# Altium project Project-C_VOLTAGE.PrjPCB (part 1 of 6)
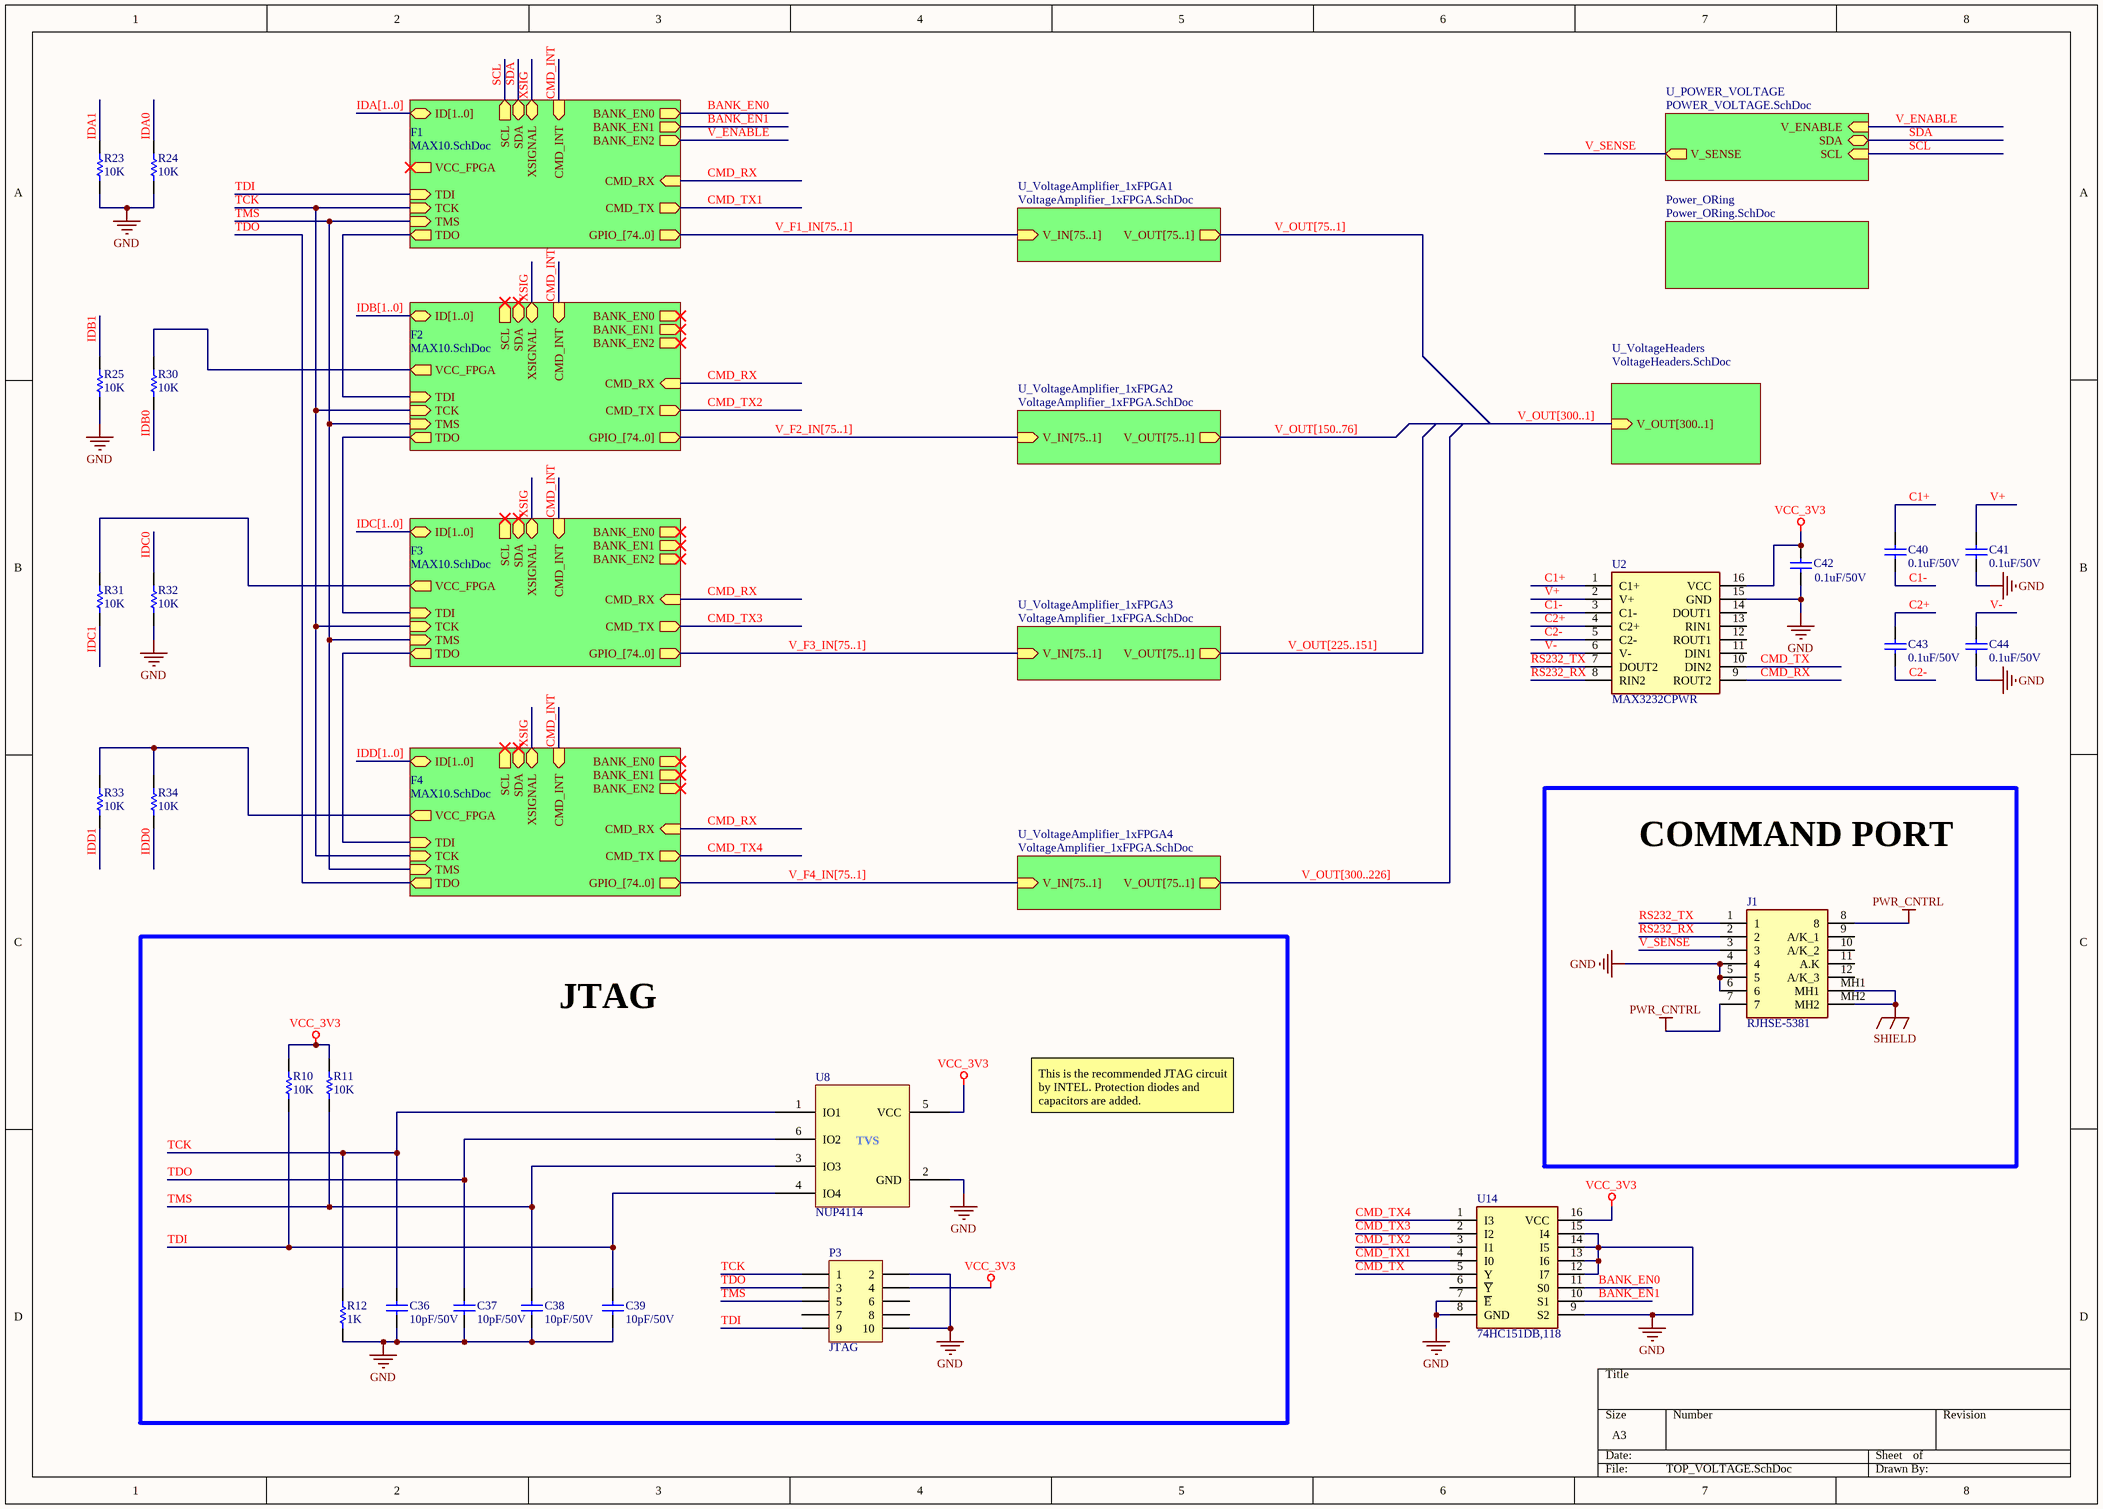
[diagram p0: TOP_VOLTAGE.SchDoc]
9 sheets, 1249 parts. Net scope: hierarchical (ports join the sheet entries above them; power ports are global).
Board file: PCB2.PcbDoc
Sheets:
  TOP_VOLTAGE.SchDoc
    F1 = MAX10.SchDoc
      IO = FPGA_IO.SchDoc
      POWER = FPGA_POWER.SchDoc
    U_VoltageHeaders = VoltageHeaders.SchDoc
    U_POWER_VOLTAGE = POWER_VOLTAGE.SchDoc
    F2 = MAX10.SchDoc
      IO = FPGA_IO.SchDoc
      POWER = FPGA_POWER.SchDoc
    F3 = MAX10.SchDoc
      IO = FPGA_IO.SchDoc
      POWER = FPGA_POWER.SchDoc
    F4 = MAX10.SchDoc
      IO = FPGA_IO.SchDoc
      POWER = FPGA_POWER.SchDoc
    Power_ORing = Power_ORing.SchDoc
    U_VoltageAmplifier_1xFPGA1 = VoltageAmplifier_1xFPGA.SchDoc
      U_VoltageAmplifier1 = VoltageAmplifier.SchDoc
      U_VoltageAmplifier2 = VoltageAmplifier.SchDoc
      U_VoltageAmplifier3 = VoltageAmplifier.SchDoc
      U_VoltageAmplifier4 = VoltageAmplifier.SchDoc
      U_VoltageAmplifier5 = VoltageAmplifier.SchDoc
      U_VoltageAmplifier6 = VoltageAmplifier.SchDoc
      U_VoltageAmplifier7 = VoltageAmplifier.SchDoc
      U_VoltageAmplifier8 = VoltageAmplifier.SchDoc
      U_VoltageAmplifier9 = VoltageAmplifier.SchDoc
      U_VoltageAmplifier10 = VoltageAmplifier.SchDoc
      U_VoltageAmplifier11 = VoltageAmplifier.SchDoc
      U_VoltageAmplifier12 = VoltageAmplifier.SchDoc
      U_VoltageAmplifier13 = VoltageAmplifier.SchDoc
      U_VoltageAmplifier14 = VoltageAmplifier.SchDoc
      U_VoltageAmplifier15 = VoltageAmplifier.SchDoc
      U_VoltageAmplifier16 = VoltageAmplifier.SchDoc
      U_VoltageAmplifier17 = VoltageAmplifier.SchDoc
      U_VoltageAmplifier18 = VoltageAmplifier.SchDoc
      U_VoltageAmplifier19 = VoltageAmplifier.SchDoc
      U_VoltageAmplifier20 = VoltageAmplifier.SchDoc
      U_VoltageAmplifier21 = VoltageAmplifier.SchDoc
      U_VoltageAmplifier22 = VoltageAmplifier.SchDoc
      U_VoltageAmplifier23 = VoltageAmplifier.SchDoc
      U_VoltageAmplifier24 = VoltageAmplifier.SchDoc
      U_VoltageAmplifier25 = VoltageAmplifier.SchDoc
      U_VoltageAmplifier26 = VoltageAmplifier.SchDoc
      U_VoltageAmplifier27 = VoltageAmplifier.SchDoc
      U_VoltageAmplifier28 = VoltageAmplifier.SchDoc
      U_VoltageAmplifier29 = VoltageAmplifier.SchDoc
      U_VoltageAmplifier30 = VoltageAmplifier.SchDoc
      U_VoltageAmplifier31 = VoltageAmplifier.SchDoc
      U_VoltageAmplifier32 = VoltageAmplifier.SchDoc
      U_VoltageAmplifier33 = VoltageAmplifier.SchDoc
      U_VoltageAmplifier34 = VoltageAmplifier.SchDoc
      U_VoltageAmplifier35 = VoltageAmplifier.SchDoc
      U_VoltageAmplifier36 = VoltageAmplifier.SchDoc
      U_VoltageAmplifier37 = VoltageAmplifier.SchDoc
      U_VoltageAmplifier38 = VoltageAmplifier.SchDoc
    U_VoltageAmplifier_1xFPGA2 = VoltageAmplifier_1xFPGA.SchDoc
      U_VoltageAmplifier1 = VoltageAmplifier.SchDoc
      U_VoltageAmplifier2 = VoltageAmplifier.SchDoc
      U_VoltageAmplifier3 = VoltageAmplifier.SchDoc
      U_VoltageAmplifier4 = VoltageAmplifier.SchDoc
      U_VoltageAmplifier5 = VoltageAmplifier.SchDoc
      U_VoltageAmplifier6 = VoltageAmplifier.SchDoc
      U_VoltageAmplifier7 = VoltageAmplifier.SchDoc
      U_VoltageAmplifier8 = VoltageAmplifier.SchDoc
      U_VoltageAmplifier9 = VoltageAmplifier.SchDoc
      U_VoltageAmplifier10 = VoltageAmplifier.SchDoc
      U_VoltageAmplifier11 = VoltageAmplifier.SchDoc
      U_VoltageAmplifier12 = VoltageAmplifier.SchDoc
      U_VoltageAmplifier13 = VoltageAmplifier.SchDoc
      U_VoltageAmplifier14 = VoltageAmplifier.SchDoc
      U_VoltageAmplifier15 = VoltageAmplifier.SchDoc
      U_VoltageAmplifier16 = VoltageAmplifier.SchDoc
      U_VoltageAmplifier17 = VoltageAmplifier.SchDoc
      U_VoltageAmplifier18 = VoltageAmplifier.SchDoc
      U_VoltageAmplifier19 = VoltageAmplifier.SchDoc
      U_VoltageAmplifier20 = VoltageAmplifier.SchDoc
      U_VoltageAmplifier21 = VoltageAmplifier.SchDoc
      U_VoltageAmplifier22 = VoltageAmplifier.SchDoc
      U_VoltageAmplifier23 = VoltageAmplifier.SchDoc
      U_VoltageAmplifier24 = VoltageAmplifier.SchDoc
      U_VoltageAmplifier25 = VoltageAmplifier.SchDoc
      U_VoltageAmplifier26 = VoltageAmplifier.SchDoc
      U_VoltageAmplifier27 = VoltageAmplifier.SchDoc
      U_VoltageAmplifier28 = VoltageAmplifier.SchDoc
      U_VoltageAmplifier29 = VoltageAmplifier.SchDoc
      U_VoltageAmplifier30 = VoltageAmplifier.SchDoc
      U_VoltageAmplifier31 = VoltageAmplifier.SchDoc
      U_VoltageAmplifier32 = VoltageAmplifier.SchDoc
      U_VoltageAmplifier33 = VoltageAmplifier.SchDoc
      U_VoltageAmplifier34 = VoltageAmplifier.SchDoc
      U_VoltageAmplifier35 = VoltageAmplifier.SchDoc
      U_VoltageAmplifier36 = VoltageAmplifier.SchDoc
      U_VoltageAmplifier37 = VoltageAmplifier.SchDoc
      U_VoltageAmplifier38 = VoltageAmplifier.SchDoc
    U_VoltageAmplifier_1xFPGA3 = VoltageAmplifier_1xFPGA.SchDoc
      U_VoltageAmplifier1 = VoltageAmplifier.SchDoc
      U_VoltageAmplifier2 = VoltageAmplifier.SchDoc
      U_VoltageAmplifier3 = VoltageAmplifier.SchDoc
      U_VoltageAmplifier4 = VoltageAmplifier.SchDoc
      U_VoltageAmplifier5 = VoltageAmplifier.SchDoc
      U_VoltageAmplifier6 = VoltageAmplifier.SchDoc
      U_VoltageAmplifier7 = VoltageAmplifier.SchDoc
      U_VoltageAmplifier8 = VoltageAmplifier.SchDoc
      U_VoltageAmplifier9 = VoltageAmplifier.SchDoc
      U_VoltageAmplifier10 = VoltageAmplifier.SchDoc
      U_VoltageAmplifier11 = VoltageAmplifier.SchDoc
      U_VoltageAmplifier12 = VoltageAmplifier.SchDoc
      U_VoltageAmplifier13 = VoltageAmplifier.SchDoc
      U_VoltageAmplifier14 = VoltageAmplifier.SchDoc
      U_VoltageAmplifier15 = VoltageAmplifier.SchDoc
      U_VoltageAmplifier16 = VoltageAmplifier.SchDoc
      U_VoltageAmplifier17 = VoltageAmplifier.SchDoc
      U_VoltageAmplifier18 = VoltageAmplifier.SchDoc
      U_VoltageAmplifier19 = VoltageAmplifier.SchDoc
      U_VoltageAmplifier20 = VoltageAmplifier.SchDoc
      U_VoltageAmplifier21 = VoltageAmplifier.SchDoc
      U_VoltageAmplifier22 = VoltageAmplifier.SchDoc
      U_VoltageAmplifier23 = VoltageAmplifier.SchDoc
      U_VoltageAmplifier24 = VoltageAmplifier.SchDoc
      U_VoltageAmplifier25 = VoltageAmplifier.SchDoc
      U_VoltageAmplifier26 = VoltageAmplifier.SchDoc
      U_VoltageAmplifier27 = VoltageAmplifier.SchDoc
      U_VoltageAmplifier28 = VoltageAmplifier.SchDoc
      U_VoltageAmplifier29 = VoltageAmplifier.SchDoc
      U_VoltageAmplifier30 = VoltageAmplifier.SchDoc
      U_VoltageAmplifier31 = VoltageAmplifier.SchDoc
      U_VoltageAmplifier32 = VoltageAmplifier.SchDoc
      U_VoltageAmplifier33 = VoltageAmplifier.SchDoc
      U_VoltageAmplifier34 = VoltageAmplifier.SchDoc
      U_VoltageAmplifier35 = VoltageAmplifier.SchDoc
      U_VoltageAmplifier36 = VoltageAmplifier.SchDoc
      U_VoltageAmplifier37 = VoltageAmplifier.SchDoc
      U_VoltageAmplifier38 = VoltageAmplifier.SchDoc
    U_VoltageAmplifier_1xFPGA4 = VoltageAmplifier_1xFPGA.SchDoc
      U_VoltageAmplifier1 = VoltageAmplifier.SchDoc
      U_VoltageAmplifier2 = VoltageAmplifier.SchDoc
      U_VoltageAmplifier3 = VoltageAmplifier.SchDoc
      U_VoltageAmplifier4 = VoltageAmplifier.SchDoc
      U_VoltageAmplifier5 = VoltageAmplifier.SchDoc
      U_VoltageAmplifier6 = VoltageAmplifier.SchDoc
      U_VoltageAmplifier7 = VoltageAmplifier.SchDoc
      U_VoltageAmplifier8 = VoltageAmplifier.SchDoc
      U_VoltageAmplifier9 = VoltageAmplifier.SchDoc
      U_VoltageAmplifier10 = VoltageAmplifier.SchDoc
      U_VoltageAmplifier11 = VoltageAmplifier.SchDoc
      U_VoltageAmplifier12 = VoltageAmplifier.SchDoc
      U_VoltageAmplifier13 = VoltageAmplifier.SchDoc
      U_VoltageAmplifier14 = VoltageAmplifier.SchDoc
      U_VoltageAmplifier15 = VoltageAmplifier.SchDoc
      U_VoltageAmplifier16 = VoltageAmplifier.SchDoc
      U_VoltageAmplifier17 = VoltageAmplifier.SchDoc
      U_VoltageAmplifier18 = VoltageAmplifier.SchDoc
      U_VoltageAmplifier19 = VoltageAmplifier.SchDoc
      U_VoltageAmplifier20 = VoltageAmplifier.SchDoc
      U_VoltageAmplifier21 = VoltageAmplifier.SchDoc
      U_VoltageAmplifier22 = VoltageAmplifier.SchDoc
      U_VoltageAmplifier23 = VoltageAmplifier.SchDoc
      U_VoltageAmplifier24 = VoltageAmplifier.SchDoc
      U_VoltageAmplifier25 = VoltageAmplifier.SchDoc
      U_VoltageAmplifier26 = VoltageAmplifier.SchDoc
      U_VoltageAmplifier27 = VoltageAmplifier.SchDoc
      U_VoltageAmplifier28 = VoltageAmplifier.SchDoc
      U_VoltageAmplifier29 = VoltageAmplifier.SchDoc
      U_VoltageAmplifier30 = VoltageAmplifier.SchDoc
      U_VoltageAmplifier31 = VoltageAmplifier.SchDoc
      U_VoltageAmplifier32 = VoltageAmplifier.SchDoc
      U_VoltageAmplifier33 = VoltageAmplifier.SchDoc
      U_VoltageAmplifier34 = VoltageAmplifier.SchDoc
      U_VoltageAmplifier35 = VoltageAmplifier.SchDoc
      U_VoltageAmplifier36 = VoltageAmplifier.SchDoc
      U_VoltageAmplifier37 = VoltageAmplifier.SchDoc
      U_VoltageAmplifier38 = VoltageAmplifier.SchDoc

## Sheet TOP_VOLTAGE.SchDoc
size A3

### Parts
C36  10pF/50V  [0603C]
C37  10pF/50V  [0603C]
C38  10pF/50V  [0603C]
C39  10pF/50V  [0603C]
C40  0.1uF/50V  [0603C]
C41  0.1uF/50V  [0603C]
C42  0.1uF/50V  [0603C]
C43  0.1uF/50V  [0603C]
C44  0.1uF/50V  [0603C]
J1  RJHSE-5381  [RJHSE5381]
P3  JTAG  [HDR2X5]  (no BOM)
R10  10K  [0603R]
R11  10K  [0603R]
R12  1K  [0603R]
R23  10K  [0603R]
R24  10K  [0603R]
R25  10K  [0603R]
R30  10K  [0603R]
R31  10K  [0603R]
R32  10K  [0603R]
R33  10K  [0603R]
R34  10K  [0603R]
U2  MAX3232CPWR  [MAX3232CPWR]
U8  NUP4114  [NUP4114HMR6T1G]
U14  74HC151DB,118  [74HC151DB,118]

### Blocks framed on the sheet
COMMAND PORT: J1
JTAG: C36-C39 P3 R10-R12 U8

### Sub-sheets
F1 = MAX10.SchDoc: TDI (in), TCK (in), TMS (in), TDO (out), CMD_RX (in), CMD_TX (out), SDA (bidir), CMD_INT (in), BANK_EN2 (out), GPIO_[74..0] (out), XSIGNAL (bidir), SCL (out), BANK_EN0 (out), BANK_EN1 (out), ID[1..0] (bidir), VCC_FPGA (out)
F2 = MAX10.SchDoc: TDI (in), TCK (in), TMS (in), TDO (out), CMD_RX (in), CMD_TX (out), SDA (bidir), CMD_INT (in), BANK_EN2 (out), GPIO_[74..0] (out), XSIGNAL (bidir), SCL (out), BANK_EN0 (out), BANK_EN1 (out), ID[1..0] (bidir), VCC_FPGA (out)
F3 = MAX10.SchDoc: TDI (in), TCK (in), TMS (in), TDO (out), CMD_RX (in), CMD_TX (out), SDA (bidir), CMD_INT (in), BANK_EN2 (out), GPIO_[74..0] (out), XSIGNAL (bidir), SCL (out), BANK_EN0 (out), BANK_EN1 (out), ID[1..0] (bidir), VCC_FPGA (out)
F4 = MAX10.SchDoc: TDI (in), TCK (in), TMS (in), TDO (out), CMD_RX (in), CMD_TX (out), SDA (bidir), CMD_INT (in), BANK_EN2 (out), GPIO_[74..0] (out), XSIGNAL (bidir), SCL (out), BANK_EN0 (out), BANK_EN1 (out), ID[1..0] (bidir), VCC_FPGA (out)
Power_ORing = Power_ORing.SchDoc: no entries
U_POWER_VOLTAGE = POWER_VOLTAGE.SchDoc: V_SENSE (out), V_ENABLE (in), SDA (bidir), SCL (in)
U_VoltageAmplifier_1xFPGA1 = VoltageAmplifier_1xFPGA.SchDoc: V_IN[75..1] (in), V_OUT[75..1] (out)
U_VoltageAmplifier_1xFPGA2 = VoltageAmplifier_1xFPGA.SchDoc: V_IN[75..1] (in), V_OUT[75..1] (out)
U_VoltageAmplifier_1xFPGA3 = VoltageAmplifier_1xFPGA.SchDoc: V_IN[75..1] (in), V_OUT[75..1] (out)
U_VoltageAmplifier_1xFPGA4 = VoltageAmplifier_1xFPGA.SchDoc: V_IN[75..1] (in), V_OUT[75..1] (out)
U_VoltageHeaders = VoltageHeaders.SchDoc: V_OUT[300..1] (in)

### Nets
GND: C36.1 C37.1 C38.1 C39.1 C41.1 C42.1 C44.1 J1.4 J1.5 J1.6 P3.2 P3.10 R12.1 R23.2 R24.2 R25.2 R32.2 U2.15(GND) U8.2(GND) U14.7(~{E}) U14.8(GND) U14.9(S2) U14.12(I7) U14.13(I6) U14.14(I5) U14.15(I4)
PWR_CNTRL: J1.7 J1.8
SHIELD: J1.MH1 J1.MH2
VCC_3V3: C42.2 P3.4 R10.1 R11.1 U2.16(VCC) U8.5(VCC) U14.16(VCC)
BANK_EN0: U14.11(S0) ; sheet F1/BANK_EN0
BANK_EN1: U14.10(S1) ; sheet F1/BANK_EN1
C1+: C40.2 U2.1(C1+)
C1-: C40.1 U2.3(C1-)
C2+: C43.2 U2.4(C2+)
C2-: C43.1 U2.5(C2-)
CMD_INT: sheet F1/CMD_INT, sheet F2/CMD_INT, sheet F3/CMD_INT, sheet F4/CMD_INT
CMD_RX: U2.9(ROUT2) ; sheet F1/CMD_RX, sheet F2/CMD_RX, sheet F3/CMD_RX, sheet F4/CMD_RX
CMD_TX: U2.10(DIN2) U14.5(Y)
CMD_TX1: U14.4(I0) ; sheet F1/CMD_TX  [project net CMD_TX]
CMD_TX2: U14.3(I1) ; sheet F2/CMD_TX  [project net CMD_TX]
CMD_TX3: U14.2(I2) ; sheet F3/CMD_TX  [project net CMD_TX]
CMD_TX4: U14.1(I3) ; sheet F4/CMD_TX  [project net CMD_TX]
IDA0: R24.1  [project net ID0]
IDA1: R23.1  [project net ID1]
IDB0: R30.2  [project net ID0]
IDB1: R25.1  [project net ID1]
IDC0: R32.1  [project net ID0]
IDC1: R31.2  [project net ID1]
IDD0: R34.2  [project net ID0]
IDD1: R33.2  [project net ID1]
RS232_RX: J1.2 U2.8(RIN2)
RS232_TX: J1.1 U2.7(DOUT2)
SCL: sheet F1/SCL, sheet U_POWER_VOLTAGE/SCL
SDA: sheet F1/SDA, sheet U_POWER_VOLTAGE/SDA
TCK: C36.2 P3.1 R12.2 U8.1(IO1) ; sheet F1/TCK, sheet F2/TCK, sheet F3/TCK, sheet F4/TCK
TDI: C39.2 P3.9 R10.2 U8.4(IO4) ; sheet F1/TDI
TDI: sheet F1/TDO, sheet F2/TDI  [a separate net that carries the same name]
TDI: sheet F2/TDO, sheet F3/TDI  [a separate net that carries the same name]
TDI: sheet F3/TDO, sheet F4/TDI  [a separate net that carries the same name]
TDO: C37.2 P3.3 U8.6(IO2) ; sheet F4/TDO
TMS: C38.2 P3.5 R11.2 U8.3(IO3) ; sheet F1/TMS, sheet F2/TMS, sheet F3/TMS, sheet F4/TMS
V+: C41.2 U2.2(V+)
V-: C44.2 U2.6(V-)
V_ENABLE: sheet F1/BANK_EN2, sheet U_POWER_VOLTAGE/V_ENABLE  [project net BANK_EN2]
V_SENSE: J1.3 ; sheet U_POWER_VOLTAGE/V_SENSE
VCC_FPGA: R30.1 ; sheet F2/VCC_FPGA
VCC_FPGA: R31.1 ; sheet F3/VCC_FPGA  [a separate net that carries the same name]
VCC_FPGA: R33.1 R34.1 ; sheet F4/VCC_FPGA  [a separate net that carries the same name]
XSIG: sheet F1/XSIGNAL, sheet F2/XSIGNAL, sheet F3/XSIGNAL, sheet F4/XSIGNAL

Not connected (* = marked no-connect by the designer): J1 9(A/K_1) 10(A/K_2) 11(A.K) 12(A/K_3); P3 6 7 8; U2 11(DIN1) 12(ROUT1) 13(RIN1) 14(DOUT1); U14 6(~{Y})

### Buses and harness runs
bus IDA[1..0] = sheet F1/ID[1..0]
bus IDB[1..0] = sheet F2/ID[1..0]
bus IDC[1..0] = sheet F3/ID[1..0]
bus IDD[1..0] = sheet F4/ID[1..0]
bus V_F1_IN[75..1] = sheet F1/GPIO_[74..0] = sheet U_VoltageAmplifier_1xFPGA1/V_IN[75..1]
bus V_F2_IN[75..1] = sheet F2/GPIO_[74..0] = sheet U_VoltageAmplifier_1xFPGA2/V_IN[75..1]
bus V_F3_IN[75..1] = sheet F3/GPIO_[74..0] = sheet U_VoltageAmplifier_1xFPGA3/V_IN[75..1]
bus V_F4_IN[75..1] = sheet F4/GPIO_[74..0] = sheet U_VoltageAmplifier_1xFPGA4/V_IN[75..1]
bus V_OUT[75..1] = sheet U_VoltageAmplifier_1xFPGA1/V_OUT[75..1]
bus V_OUT[150..76] = sheet U_VoltageAmplifier_1xFPGA2/V_OUT[75..1]
bus V_OUT[225..151] = sheet U_VoltageAmplifier_1xFPGA3/V_OUT[75..1]
bus V_OUT[300..1] = sheet U_VoltageHeaders/V_OUT[300..1]
bus V_OUT[300..226] = sheet U_VoltageAmplifier_1xFPGA4/V_OUT[75..1]

### Notes on the sheet
- This is the recommended JTAG circuit by INTEL. Protection diodes and capacitors are added.

### Library data of the parts
C36-C39 = Cap: Multilayer Ceramic Capacitors MLCC - SMD/SMT 50V 10pF 0603 C0G 5% AEC-Q200; Mfr: KEMET; Mfr Part No: C0603C100J5GACAUTO; Package: 0603; Price: 0.192; Stockiest: MOUSER; Stockiest Part No: 80-C0603C100J5GAUTO; Value: 10pF/50V
C40-C44 = Cap: Multilayer Ceramic Capacitors MLCC - SMD/SMT 50V 0.1uF 0603 X7R 20%; Mfr: KEMET; Mfr Part No: C0603C104M5RACTU; Package: 0603; Price: 0.101; Stockiest: MOUSER; Stockiest Part No: 80-C0603C104M5R; Value: 0.1uF/50V
J1 = RJHSE-5381: Modular Connectors / Ethernet Connectors R/A RJ45 SHEILDED 8 CONT Y/G LEDS; Mfr: Amphenol Commercial Products; Mfr Part No: RJHSE-5381; Price: 1.77; Stockiest: MOUSER; Stockiest Part No: 523-RJHSE-5381
P3 = Header 5X2: Header, 5-Pin, Dual row; Stockiest: MOUSER
R10 R11 R23-R25 R30-R34 = Res1: Thick Film Resistors - SMD 0603 10Kohms 1% Anti-Sulfur AEC-Q200; Mfr: ROHM Semiconductor; Mfr Part No: SFR03EZPF1002; Package: 0603; Price: 0.101; Stockiest: MOUSER; Stockiest Part No: 755-SFR03EZPF1002; Value: 10K
R12 = Res1: Resistor; Mfr: Vishay / Dale; Mfr Part No: CRCW06031K00FKEAC; Package: 0603; Price: 0.1; Stockiest: MOUSER; Stockiest Part No: 71-CRCW06031K00FKEAC; Value: 1K
U2 = MAX3232CPWR: RS-232 Interface IC 3-5.5V Mult-Ch RS232; Mfr: Texas Instruments; Mfr Part No: MAX3232CPWR; Price: 0.94; Stockiest: MOUSER; Stockiest Part No: 595-MAX3232CPWR
U8 = NUP4114: ESD Suppressors / TVS Diodes LOW CAP TVS ARRAY 5.5V; Mfr: ON SEMI; Mfr Part No: NUP4114HMR6T1G; Price: 0.534; Stockiest: MOUSER; Stockiest Part No: 863-NUP4114HMR6T1G; Value: TVS
U14 = 74HC151DB,118: Encoders, Decoders, Multiplexers & Demultiplexers 8-INPUT MULTIPLEXER; Mfr: NEXPERIA; Mfr Part No: 74HC151DB,118; Price: 0.887; Stockiest: MOUSER; Stockiest Part No: 771-HC151DB118

## Sheet MAX10.SchDoc
size B
Used 4 times, as channels F1, F2, F3, F4. Parts and nets are listed once, with the designators drawn on the sheet.
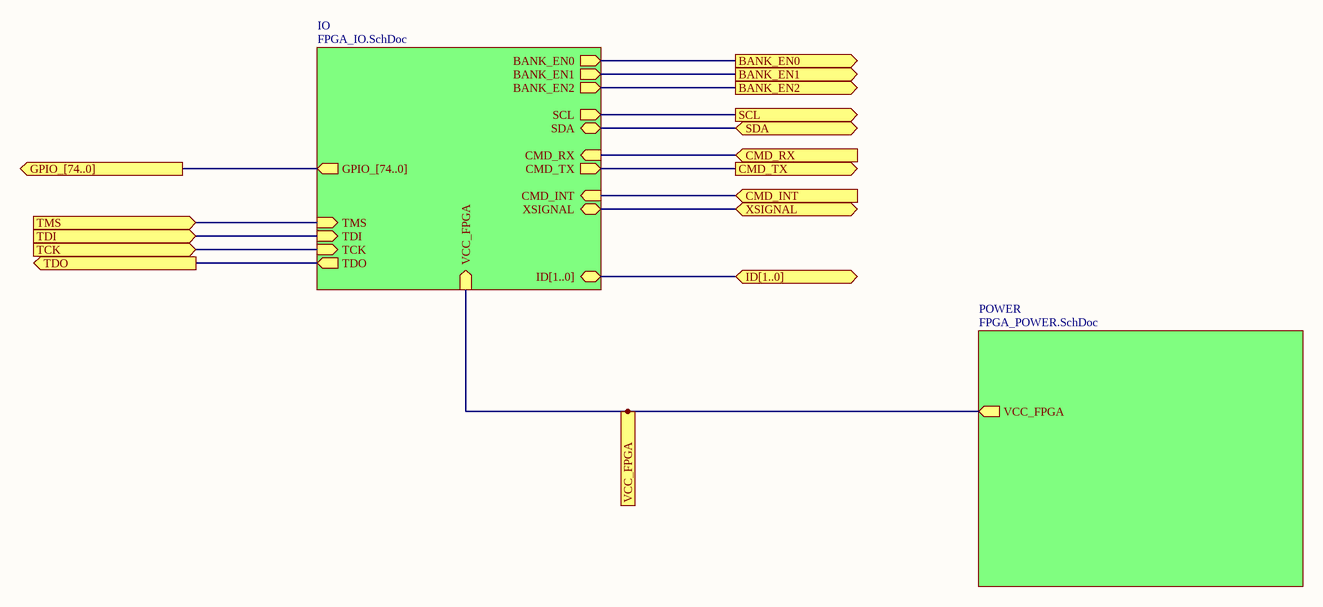
[diagram p1: MAX10.SchDoc]

### Sub-sheets
IO = FPGA_IO.SchDoc: CMD_RX (in), CMD_TX (out), BANK_EN1 (out), BANK_EN0 (out), SDA (bidir), CMD_INT (in), BANK_EN2 (out), SCL (out), GPIO_[74..0] (out), XSIGNAL (bidir), ID[1..0] (bidir), TMS (in), TDI (in), TCK (in), TDO (out), VCC_FPGA (in)
POWER = FPGA_POWER.SchDoc: VCC_FPGA (out)

### Ports
BANK_EN0 (out), BANK_EN1 (out), BANK_EN2 (out), CMD_INT (in), CMD_RX (in), CMD_TX (out), GPIO_[74..0] (out), ID[1..0] (bidir), SCL (out), SDA (bidir), TCK (in), TDI (in), TDO (out), TMS (in), VCC_FPGA (out), XSIGNAL (bidir)

### Nets
BANK_EN0: port BANK_EN0, sheet IO/BANK_EN0
BANK_EN1: port BANK_EN1, sheet IO/BANK_EN1
BANK_EN2: port BANK_EN2, sheet IO/BANK_EN2
CMD_INT: port CMD_INT, sheet IO/CMD_INT
CMD_RX: port CMD_RX, sheet IO/CMD_RX
CMD_TX: port CMD_TX, sheet IO/CMD_TX
SCL: port SCL, sheet IO/SCL
SDA: port SDA, sheet IO/SDA
TCK: port TCK, sheet IO/TCK
TDI: port TDI, sheet IO/TDI
TDO: port TDO, sheet IO/TDO
TMS: port TMS, sheet IO/TMS
VCC_FPGA: port VCC_FPGA, sheet IO/VCC_FPGA, sheet POWER/VCC_FPGA
XSIGNAL: port XSIGNAL, sheet IO/XSIGNAL

### Channels
F1: ports BANK_EN0=BANK_EN0 BANK_EN1=BANK_EN1 BANK_EN2=BANK_EN2 CMD_INT=CMD_INT CMD_RX=CMD_RX CMD_TX=CMD_TX SCL=SCL SDA=SDA TCK=TCK TDI=TDI TDO=TDI TMS=TMS VCC_FPGA=VCC_FPGA XSIGNAL=XSIG
F2: ports BANK_EN0=BANK_EN0_IO BANK_EN1=BANK_EN1_IO BANK_EN2=BANK_EN2_IO CMD_INT=CMD_INT CMD_RX=CMD_RX CMD_TX=CMD_TX SCL=SCL_IO SDA=SDA_IO TCK=TCK TDI=TDI TDO=TDI TMS=TMS VCC_FPGA=VCC_FPGA XSIGNAL=XSIG
F3: ports BANK_EN0=BANK_EN0_IO BANK_EN1=BANK_EN1_IO BANK_EN2=BANK_EN2_IO CMD_INT=CMD_INT CMD_RX=CMD_RX CMD_TX=CMD_TX SCL=SCL_IO SDA=SDA_IO TCK=TCK TDI=TDI TDO=TDI TMS=TMS VCC_FPGA=VCC_FPGA XSIGNAL=XSIG
F4: ports BANK_EN0=BANK_EN0_IO BANK_EN1=BANK_EN1_IO BANK_EN2=BANK_EN2_IO CMD_INT=CMD_INT CMD_RX=CMD_RX CMD_TX=CMD_TX SCL=SCL_IO SDA=SDA_IO TCK=TCK TDI=TDI TDO=TDO TMS=TMS VCC_FPGA=VCC_FPGA XSIGNAL=XSIG

### Buses and harness runs
bus port GPIO_[74..0] = sheet IO/GPIO_[74..0]
bus port ID[1..0] = sheet IO/ID[1..0]

## Sheet FPGA_IO.SchDoc
size B
Used 4 times, as channels F1/IO, F2/IO, F3/IO, F4/IO. Parts and nets are listed once, with the designators drawn on the sheet.
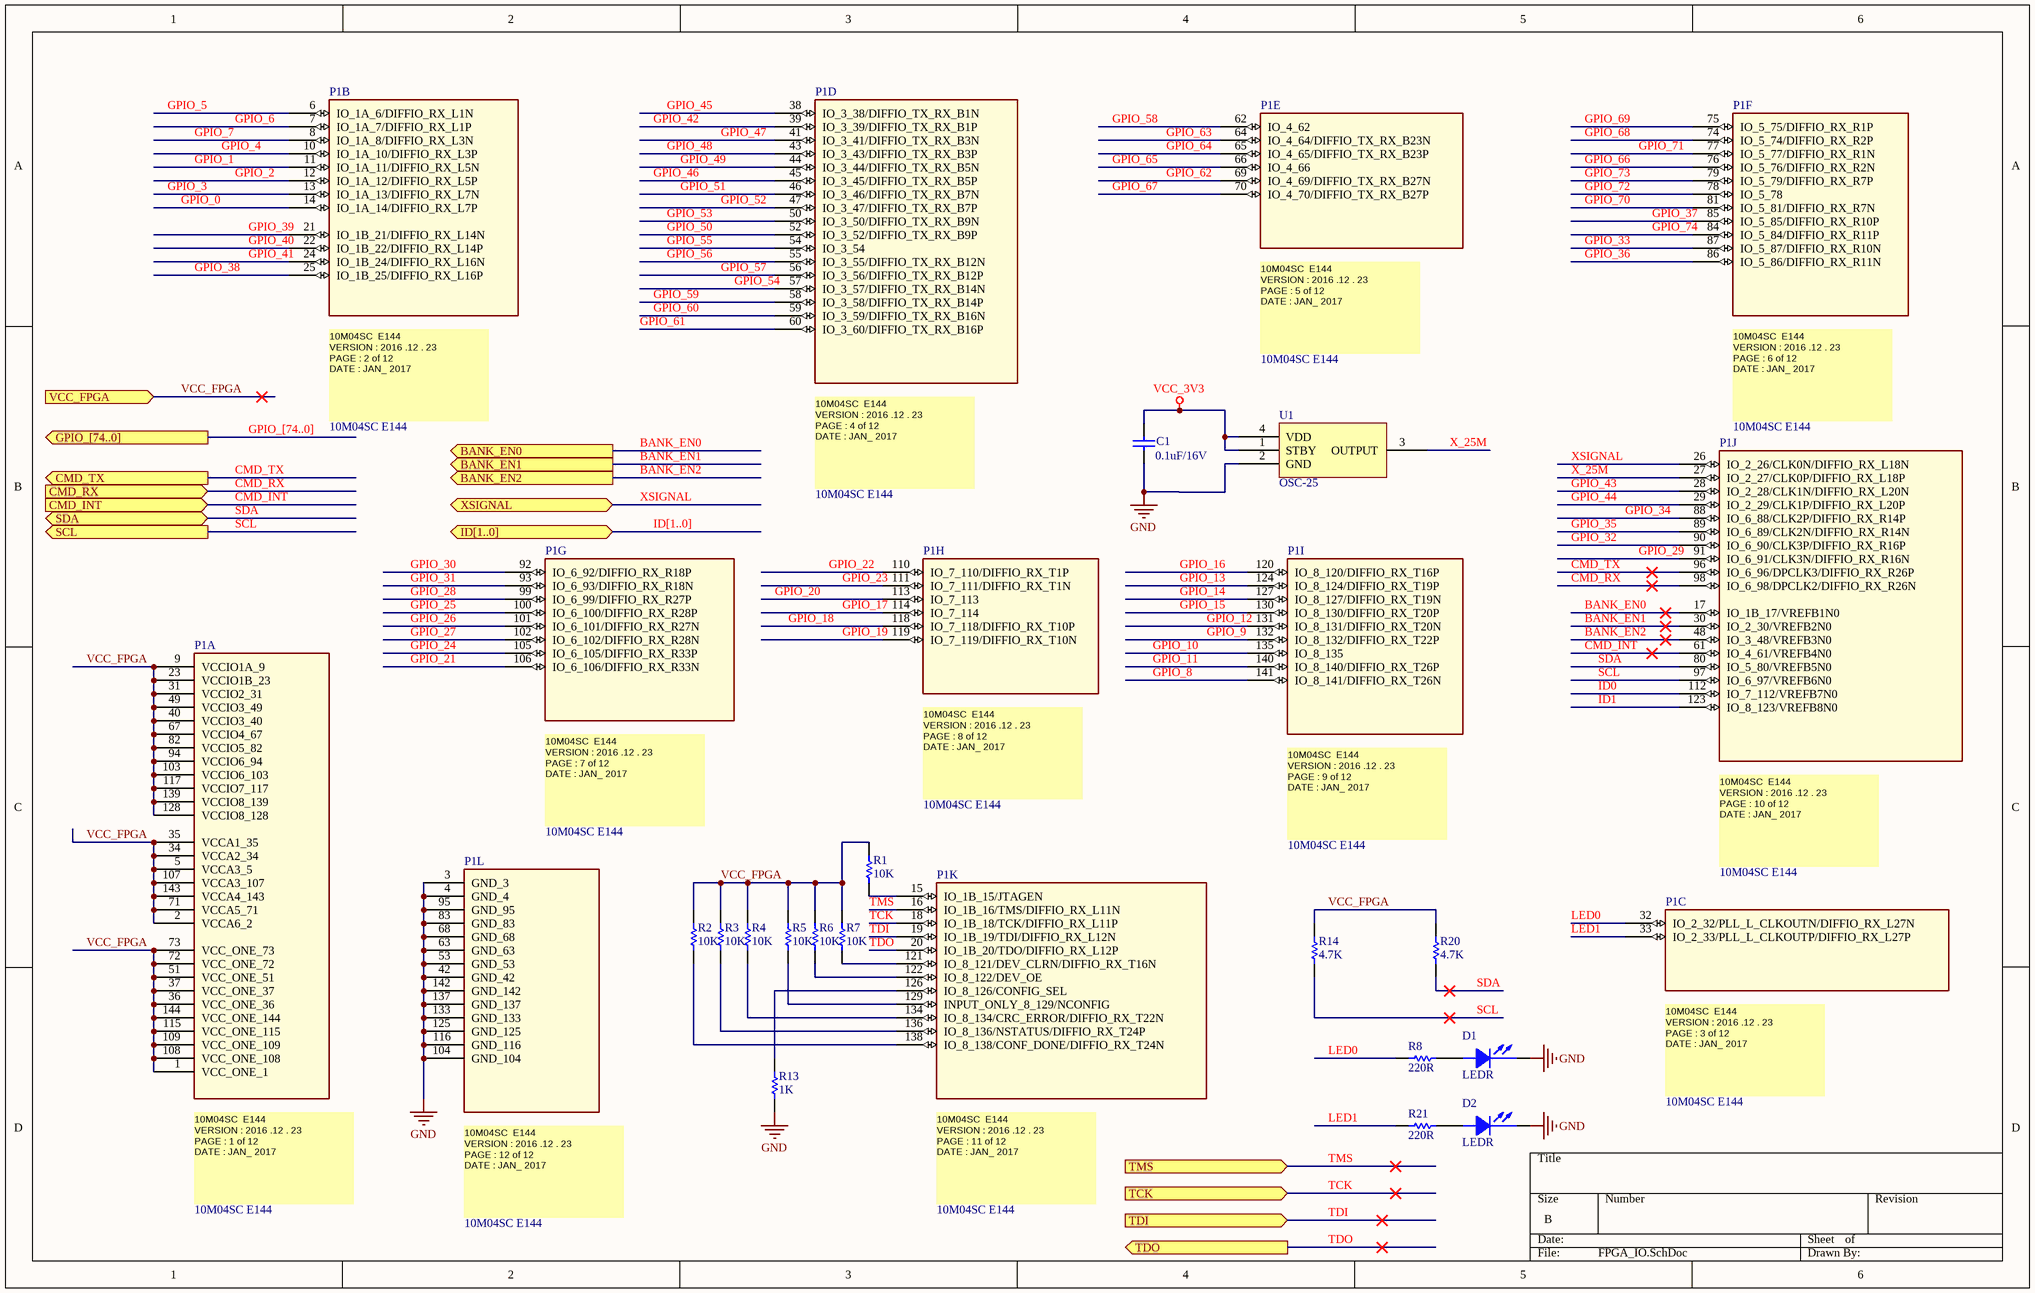
[diagram p2: FPGA_IO.SchDoc]

### Parts
C1  0.1uF/16V  [0603C]
D1  LEDR  [LED_0603]
D2  LEDR  [LED_0603]
P1  10M04SC E144  [10M04SCE144C8G]  (parts A,B,C,D,E,F,G,H,I,J,K,L of 12)
R1  10K  [0603R]
R2  10K  [0603R]
R3  10K  [0603R]
R4  10K  [0603R]
R5  10K  [0603R]
R6  10K  [0603R]
R7  10K  [0603R]
R8  220R  [0603R]
R13  1K  [0603R]
R14  4.7K  [0603R]
R20  4.7K  [0603R]
R21  220R  [0603R]
U1  OSC-25  [ASE-25.000MHZ-LC-T]

### Ports
BANK_EN0 (out), BANK_EN1 (out), BANK_EN2 (out), CMD_INT (in), CMD_RX (in), CMD_TX (out), GPIO_[74..0] (out), ID[1..0] (bidir), SCL (out), SDA (bidir), TCK (in), TDI (in), TDO (out), TMS (in), VCC_FPGA (in), XSIGNAL (bidir)

### Nets
GND: C1.1 D1.2(CATHODE) D2.2(CATHODE) P1.3(GND_3) P1.4(GND_4) P1.42(GND_42) P1.53(GND_53) P1.63(GND_63) P1.68(GND_68) P1.83(GND_83) P1.95(GND_95) P1.104(GND_104) P1.116(GND_116) P1.125(GND_125) P1.133(GND_133) P1.137(GND_137) P1.142(GND_142) R13.1 U1.2(GND)
VCC_3V3: C1.2 U1.1(STBY) U1.4(VDD)
BANK_EN0: P1.17(IO_1B_17/VREFB1N0) ; port BANK_EN0
BANK_EN1: P1.30(IO_2_30/VREFB2N0) ; port BANK_EN1
BANK_EN2: P1.48(IO_3_48/VREFB3N0) ; port BANK_EN2
CMD_INT: P1.61(IO_4_61/VREFB4N0) ; port CMD_INT
CMD_RX: P1.98(IO_6_98/DPCLK2/DIFFIO_RX_R26N) ; port CMD_RX
CMD_TX: P1.96(IO_6_96/DPCLK3/DIFFIO_RX_R26P) ; port CMD_TX
GPIO_0: P1.14(IO_1A_14/DIFFIO_RX_L7P)
GPIO_1: P1.11(IO_1A_11/DIFFIO_RX_L5N)
GPIO_2: P1.12(IO_1A_12/DIFFIO_RX_L5P)
GPIO_3: P1.13(IO_1A_13/DIFFIO_RX_L7N)
GPIO_4: P1.10(IO_1A_10/DIFFIO_RX_L3P)
GPIO_5: P1.6(IO_1A_6/DIFFIO_RX_L1N)
GPIO_6: P1.7(IO_1A_7/DIFFIO_RX_L1P)
GPIO_7: P1.8(IO_1A_8/DIFFIO_RX_L3N)
GPIO_8: P1.141(IO_8_141/DIFFIO_RX_T26N)
GPIO_9: P1.132(IO_8_132/DIFFIO_RX_T22P)
GPIO_10: P1.135(IO_8_135)
GPIO_11: P1.140(IO_8_140/DIFFIO_RX_T26P)
GPIO_12: P1.131(IO_8_131/DIFFIO_RX_T20N)
GPIO_13: P1.124(IO_8_124/DIFFIO_RX_T19P)
GPIO_14: P1.127(IO_8_127/DIFFIO_RX_T19N)
GPIO_15: P1.130(IO_8_130/DIFFIO_RX_T20P)
GPIO_16: P1.120(IO_8_120/DIFFIO_RX_T16P)
GPIO_17: P1.114(IO_7_114)
GPIO_18: P1.118(IO_7_118/DIFFIO_RX_T10P)
GPIO_19: P1.119(IO_7_119/DIFFIO_RX_T10N)
GPIO_20: P1.113(IO_7_113)
GPIO_21: P1.106(IO_6_106/DIFFIO_RX_R33N)
GPIO_22: P1.110(IO_7_110/DIFFIO_RX_T1P)
GPIO_23: P1.111(IO_7_111/DIFFIO_RX_T1N)
GPIO_24: P1.105(IO_6_105/DIFFIO_RX_R33P)
GPIO_25: P1.100(IO_6_100/DIFFIO_RX_R28P)
GPIO_26: P1.101(IO_6_101/DIFFIO_RX_R27N)
GPIO_27: P1.102(IO_6_102/DIFFIO_RX_R28N)
GPIO_28: P1.99(IO_6_99/DIFFIO_RX_R27P)
GPIO_29: P1.91(IO_6_91/CLK3N/DIFFIO_RX_R16N)
GPIO_30: P1.92(IO_6_92/DIFFIO_RX_R18P)
GPIO_31: P1.93(IO_6_93/DIFFIO_RX_R18N)
GPIO_32: P1.90(IO_6_90/CLK3P/DIFFIO_RX_R16P)
GPIO_33: P1.87(IO_5_87/DIFFIO_RX_R10N)
GPIO_34: P1.88(IO_6_88/CLK2P/DIFFIO_RX_R14P)
GPIO_35: P1.89(IO_6_89/CLK2N/DIFFIO_RX_R14N)
GPIO_36: P1.86(IO_5_86/DIFFIO_RX_R11N)
GPIO_37: P1.85(IO_5_85/DIFFIO_RX_R10P)
GPIO_38: P1.25(IO_1B_25/DIFFIO_RX_L16P)
GPIO_39: P1.21(IO_1B_21/DIFFIO_RX_L14N)
GPIO_40: P1.22(IO_1B_22/DIFFIO_RX_L14P)
GPIO_41: P1.24(IO_1B_24/DIFFIO_RX_L16N)
GPIO_42: P1.39(IO_3_39/DIFFIO_TX_RX_B1P)
GPIO_43: P1.28(IO_2_28/CLK1N/DIFFIO_RX_L20N)
GPIO_44: P1.29(IO_2_29/CLK1P/DIFFIO_RX_L20P)
GPIO_45: P1.38(IO_3_38/DIFFIO_TX_RX_B1N)
GPIO_46: P1.45(IO_3_45/DIFFIO_TX_RX_B5P)
GPIO_47: P1.41(IO_3_41/DIFFIO_TX_RX_B3N)
GPIO_48: P1.43(IO_3_43/DIFFIO_TX_RX_B3P)
GPIO_49: P1.44(IO_3_44/DIFFIO_TX_RX_B5N)
GPIO_50: P1.52(IO_3_52/DIFFIO_TX_RX_B9P)
GPIO_51: P1.46(IO_3_46/DIFFIO_TX_RX_B7N)
GPIO_52: P1.47(IO_3_47/DIFFIO_TX_RX_B7P)
GPIO_53: P1.50(IO_3_50/DIFFIO_TX_RX_B9N)
GPIO_54: P1.57(IO_3_57/DIFFIO_TX_RX_B14N)
GPIO_55: P1.54(IO_3_54)
GPIO_56: P1.55(IO_3_55/DIFFIO_TX_RX_B12N)
GPIO_57: P1.56(IO_3_56/DIFFIO_TX_RX_B12P)
GPIO_58: P1.62(IO_4_62)
GPIO_59: P1.58(IO_3_58/DIFFIO_TX_RX_B14P)
GPIO_60: P1.59(IO_3_59/DIFFIO_TX_RX_B16N)
GPIO_61: P1.60(IO_3_60/DIFFIO_TX_RX_B16P)
GPIO_62: P1.69(IO_4_69/DIFFIO_TX_RX_B27N)
GPIO_63: P1.64(IO_4_64/DIFFIO_TX_RX_B23N)
GPIO_64: P1.65(IO_4_65/DIFFIO_TX_RX_B23P)
GPIO_65: P1.66(IO_4_66)
GPIO_66: P1.76(IO_5_76/DIFFIO_RX_R2N)
GPIO_67: P1.70(IO_4_70/DIFFIO_TX_RX_B27P)
GPIO_68: P1.74(IO_5_74/DIFFIO_RX_R2P)
GPIO_69: P1.75(IO_5_75/DIFFIO_RX_R1P)
GPIO_70: P1.81(IO_5_81/DIFFIO_RX_R7N)
GPIO_71: P1.77(IO_5_77/DIFFIO_RX_R1N)
GPIO_72: P1.78(IO_5_78)
GPIO_73: P1.79(IO_5_79/DIFFIO_RX_R7P)
GPIO_74: P1.84(IO_5_84/DIFFIO_RX_R11P)
ID0: P1.112(IO_7_112/VREFB7N0)
ID1: P1.123(IO_8_123/VREFB8N0)
LED0: P1.32(IO_2_32/PLL_L_CLKOUTN/DIFFIO_RX_L27N) R8.2
LED1: P1.33(IO_2_33/PLL_L_CLKOUTP/DIFFIO_RX_L27P) R21.2
SCL: P1.97(IO_6_97/VREFB6N0) R14.1 ; port SCL
SDA: P1.80(IO_5_80/VREFB5N0) R20.1 ; port SDA
TCK: P1.18(IO_1B_18/TCK/DIFFIO_RX_L11P) ; port TCK
TDI: P1.19(IO_1B_19/TDI/DIFFIO_RX_L12N) ; port TDI
TDO: P1.20(IO_1B_20/TDO/DIFFIO_RX_L12P) ; port TDO
TMS: P1.16(IO_1B_16/TMS/DIFFIO_RX_L11N) ; port TMS
VCC_FPGA: P1.1(VCC_ONE_1) P1.2(VCCA6_2) P1.5(VCCA3_5) P1.9(VCCIO1A_9) P1.23(VCCIO1B_23) P1.31(VCCIO2_31) P1.34(VCCA2_34) P1.35(VCCA1_35) P1.36(VCC_ONE_36) P1.37(VCC_ONE_37) P1.40(VCCIO3_40) P1.49(VCCIO3_49) P1.51(VCC_ONE_51) P1.67(VCCIO4_67) P1.71(VCCA5_71) P1.72(VCC_ONE_72) P1.73(VCC_ONE_73) P1.82(VCCIO5_82) P1.94(VCCIO6_94) P1.103(VCCIO6_103) P1.107(VCCA3_107) P1.108(VCC_ONE_108) P1.109(VCC_ONE_109) P1.115(VCC_ONE_115) P1.117(VCCIO7_117) P1.128(VCCIO8_128) P1.139(VCCIO8_139) P1.143(VCCA4_143) P1.144(VCC_ONE_144) R1.1 R2.1 R3.1 R4.1 R5.1 R6.1 R7.1 R14.2 R20.2 ; port VCC_FPGA
X_25M: P1.27(IO_2_27/CLK0P/DIFFIO_RX_L18P) U1.3(OUTPUT)
XSIGNAL: P1.26(IO_2_26/CLK0N/DIFFIO_RX_L18N) ; port XSIGNAL
NetD1_1: D1.1(ANODE) R8.1
NetD2_1: D2.1(ANODE) R21.1
NetP1_15: P1.15(IO_1B_15/JTAGEN) R1.2
NetP1_121: P1.121(IO_8_121/DEV_CLRN/DIFFIO_RX_T16N) R7.2
NetP1_122: P1.122(IO_8_122/DEV_OE) R6.2
NetP1_126: P1.126(IO_8_126/CONFIG_SEL) R13.2
NetP1_129: P1.129(INPUT_ONLY_8_129/NCONFIG) R5.2
NetP1_134: P1.134(IO_8_134/CRC_ERROR/DIFFIO_RX_T22N) R4.2
NetP1_136: P1.136(IO_8_136/NSTATUS/DIFFIO_RX_T24P) R3.2
NetP1_138: P1.138(IO_8_138/CONF_DONE/DIFFIO_RX_T24N) R2.2

### Channels
F1/IO: designators end in _F1_IO; ports BANK_EN0=BANK_EN0 BANK_EN1=BANK_EN1 BANK_EN2=BANK_EN2 CMD_INT=CMD_INT CMD_RX=CMD_RX CMD_TX=CMD_TX SCL=SCL SDA=SDA TCK=TCK TDI=TDI TDO=TDI TMS=TMS VCC_FPGA=VCC_FPGA XSIGNAL=XSIG
F2/IO: designators end in _F2_IO; ports BANK_EN0=BANK_EN0_IO BANK_EN1=BANK_EN1_IO BANK_EN2=BANK_EN2_IO CMD_INT=CMD_INT CMD_RX=CMD_RX CMD_TX=CMD_TX SCL=SCL_IO SDA=SDA_IO TCK=TCK TDI=TDI TDO=TDI TMS=TMS VCC_FPGA=VCC_FPGA XSIGNAL=XSIG
F3/IO: designators end in _F3_IO; ports BANK_EN0=BANK_EN0_IO BANK_EN1=BANK_EN1_IO BANK_EN2=BANK_EN2_IO CMD_INT=CMD_INT CMD_RX=CMD_RX CMD_TX=CMD_TX SCL=SCL_IO SDA=SDA_IO TCK=TCK TDI=TDI TDO=TDI TMS=TMS VCC_FPGA=VCC_FPGA XSIGNAL=XSIG
F4/IO: designators end in _F4_IO; ports BANK_EN0=BANK_EN0_IO BANK_EN1=BANK_EN1_IO BANK_EN2=BANK_EN2_IO CMD_INT=CMD_INT CMD_RX=CMD_RX CMD_TX=CMD_TX SCL=SCL_IO SDA=SDA_IO TCK=TCK TDI=TDI TDO=TDO TMS=TMS VCC_FPGA=VCC_FPGA XSIGNAL=XSIG

### Buses and harness runs
bus GPIO_[74..0] = port GPIO_[74..0]
bus ID[1..0] = port ID[1..0]

### Notes on the sheet
- (in symbol 10M04SC E144, part A) 10M04SC  E144 / VERSION : 2016 .12 . 23 / PAGE : 1 of 12 / DATE : JAN_ 2017 /
- (in symbol 10M04SC E144, part B) 10M04SC  E144 / VERSION : 2016 .12 . 23 / PAGE : 2 of 12 / DATE : JAN_ 2017 /
- (in symbol 10M04SC E144, part C) 10M04SC  E144 / VERSION : 2016 .12 . 23 / PAGE : 3 of 12 / DATE : JAN_ 2017 /
- (in symbol 10M04SC E144, part D) 10M04SC  E144 / VERSION : 2016 .12 . 23 / PAGE : 4 of 12 / DATE : JAN_ 2017 /
- (in symbol 10M04SC E144, part E) 10M04SC  E144 / VERSION : 2016 .12 . 23 / PAGE : 5 of 12 / DATE : JAN_ 2017 /
- (in symbol 10M04SC E144, part F) 10M04SC  E144 / VERSION : 2016 .12 . 23 / PAGE : 6 of 12 / DATE : JAN_ 2017 /
- (in symbol 10M04SC E144, part G) 10M04SC  E144 / VERSION : 2016 .12 . 23 / PAGE : 7 of 12 / DATE : JAN_ 2017 /
- (in symbol 10M04SC E144, part H) 10M04SC  E144 / VERSION : 2016 .12 . 23 / PAGE : 8 of 12 / DATE : JAN_ 2017 /
- (in symbol 10M04SC E144, part I) 10M04SC  E144 / VERSION : 2016 .12 . 23 / PAGE : 9 of 12 / DATE : JAN_ 2017 /
- (in symbol 10M04SC E144, part J) 10M04SC  E144 / VERSION : 2016 .12 . 23 / PAGE : 10 of 12 / DATE : JAN_ 2017 /
- (in symbol 10M04SC E144, part K) 10M04SC  E144 / VERSION : 2016 .12 . 23 / PAGE : 11 of 12 / DATE : JAN_ 2017 /
- (in symbol 10M04SC E144, part L) 10M04SC  E144 / VERSION : 2016 .12 . 23 / PAGE : 12 of 12 / DATE : JAN_ 2017 /

### Library data of the parts
C1 = Cap: Multilayer Ceramic Capacitors MLCC - SMD/SMT 0603 16VDC 0.1uF 10% X7R AEC-Q200; Mfr: Taiyo Yuden; Mfr Part No: EMK107B7104KAHT; Package: 0603; Price: 0.101; Stockiest: MOUSER; Stockiest Part No: 963-EMK107B7104KAHT; Value: 0.1uF/16V
D1 D2 = LED: Standard LEDs - SMD Red 631nm 14mcd 5mA; Mfr: Lite-On; Mfr Part No: LTST-C193KRKT-5A; Package: 0603; Price: 0.393; Stockiest: MOUSER; Stockiest Part No: 859-LTSTC193KRKT5A; Value: RED
P1 = 10M04SC E144: FPGA - Field Programmable Gate Array non-volatile FPGA, 101 I/O, 144EQFP; Mfr: Intel / Altera; Mfr Part No: 10M04SCE144C8G; Package: EQFP144; Price: 11.52; Stockiest: MOUSER; Stockiest Part No: 989-10M04SCE144C8G
R1-R7 = Res1: as R10 on sheet TOP_VOLTAGE; Package: 0603; Price: 0.101; Stockiest: MOUSER; Stockiest Part No: 755-SFR03EZPF1002; Value: 10K
R8 R21 = Res1: Thick Film Resistors - SMD 1/10Watt 220ohms 5% Commercial Use; Mfr: Vishay / Dale; Mfr Part No: CRCW0603220RJNEAC; Package: 0603; Price: 0.101; Stockiest: MOUSER; Stockiest Part No: 71-CRCW0603220RJNEAC; Value: 220R
R13 = Res1: as R12 on sheet TOP_VOLTAGE; Package: 0603; Price: 0.1; Stockiest: MOUSER; Stockiest Part No: 71-CRCW06031K00FKEAC; Value: 1K
R14 R20 = Res1: Thick Film Resistors - SMD 1/10Watt 4.7Kohms 5% Commercial Use; Mfr: Vishay / Dale; Mfr Part No: CRCW06034K70JNEAC; Package: 0603; Price: 0.101; Stockiest: MOUSER; Stockiest Part No: 71-CRCW06034K70JNEAC; Value: 4.7K
U1 = CRYSTAL: Standard Clock Oscillators 25.0 MHZ 3.3V 50PPM SMD 32; Mfr: ABRACON; Value: 25MHZ; Mfr Part No: ASE-25.000MHZ-LC-T; Price: 1.42; Stockiest: MOUSER; Stockiest Part No: 815-ASE25.000MHZLCT

## Sheet FPGA_POWER.SchDoc
size B
Used 4 times, as channels F1/POWER, F2/POWER, F3/POWER, F4/POWER. Parts and nets are listed once, with the designators drawn on the sheet.
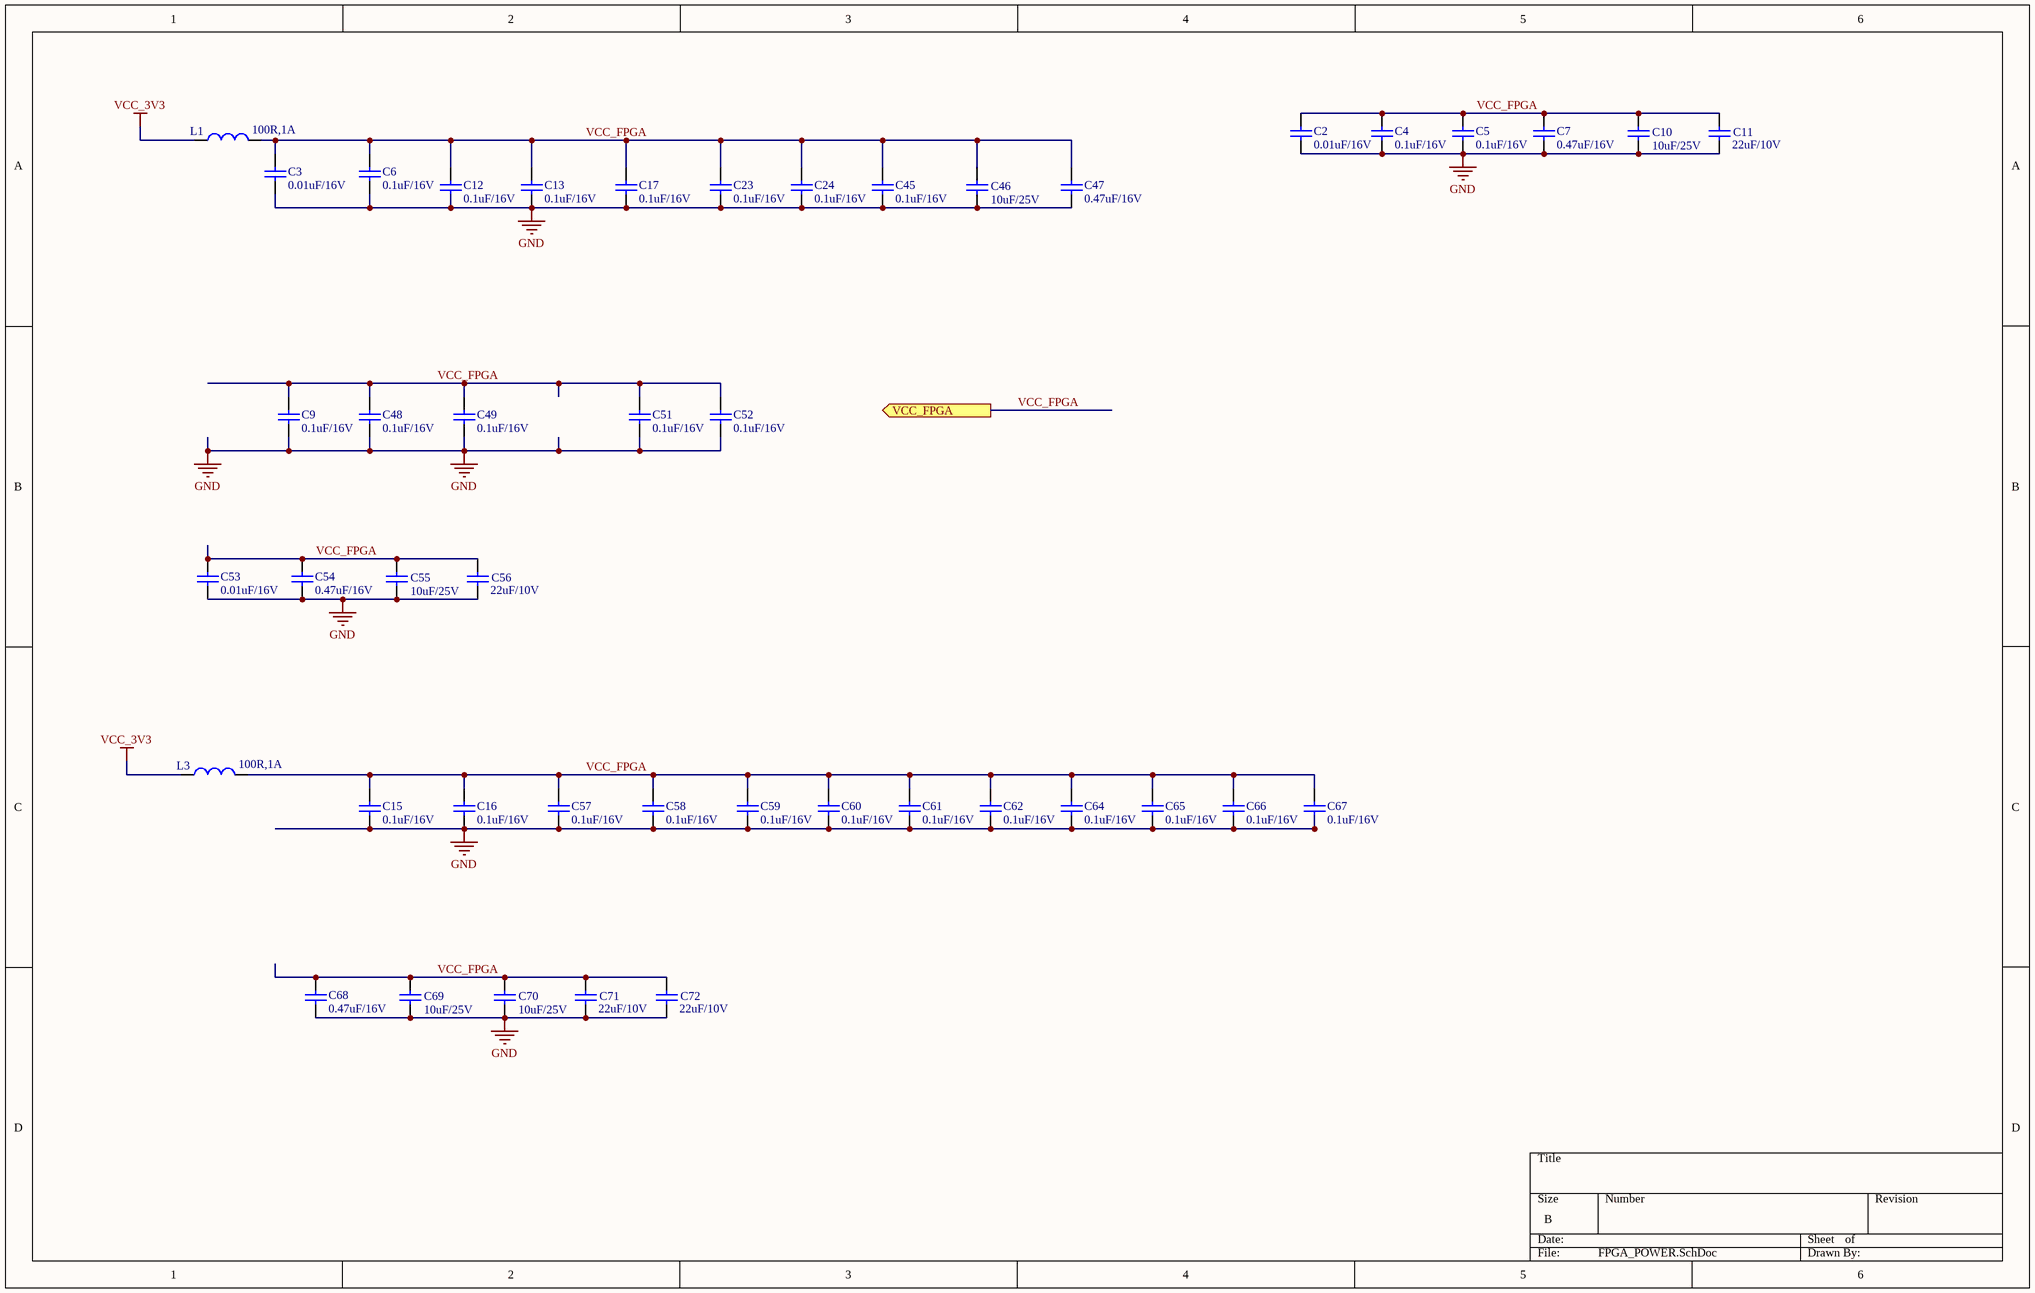
[diagram p3: FPGA_POWER.SchDoc]

### Parts
C2  0.01uF/16V  [0603C]
C3  0.01uF/16V  [0603C]
C4  0.1uF/16V  [0603C]
C5  0.1uF/16V  [0603C]
C6  0.1uF/16V  [0603C]
C7  0.47uF/16V  [0603C]
C9  0.1uF/16V  [0603C]
C10  10uF/25V  [0805C]
C11  22uF/10V  [0603C]
C12  0.1uF/16V  [0603C]
C13  0.1uF/16V  [0603C]
C15  0.1uF/16V  [0603C]
C16  0.1uF/16V  [0603C]
C17  0.1uF/16V  [0603C]
C23  0.1uF/16V  [0603C]
C24  0.1uF/16V  [0603C]
C45  0.1uF/16V  [0603C]
C46  10uF/25V  [0805C]
C47  0.47uF/16V  [0603C]
C48  0.1uF/16V  [0603C]
C49  0.1uF/16V  [0603C]
C51  0.1uF/16V  [0603C]
C52  0.1uF/16V  [0603C]
C53  0.01uF/16V  [0603C]
C54  0.47uF/16V  [0603C]
C55  10uF/25V  [0805C]
C56  22uF/10V  [0603C]
C57  0.1uF/16V  [0603C]
C58  0.1uF/16V  [0603C]
C59  0.1uF/16V  [0603C]
C60  0.1uF/16V  [0603C]
C61  0.1uF/16V  [0603C]
C62  0.1uF/16V  [0603C]
C64  0.1uF/16V  [0603C]
C65  0.1uF/16V  [0603C]
C66  0.1uF/16V  [0603C]
C67  0.1uF/16V  [0603C]
C68  0.47uF/16V  [0603C]
C69  10uF/25V  [0805C]
C70  10uF/25V  [0805C]
C71  22uF/10V  [0603C]
C72  22uF/10V  [0603C]
L1  100R,1A  [0603L]
L3  100R,1A  [0603L]

### Ports
VCC_FPGA (out)

### Nets
GND: C2.2 C3.2 C4.2 C5.2 C6.2 C7.2 C9.2 C10.1 C11.1 C12.2 C13.2 C15.2 C16.2 C17.2 C23.2 C24.2 C45.2 C46.1 C47.2 C48.2 C49.2 C51.2 C52.2 C53.2 C54.2 C55.1 C56.1 C57.2 C58.2 C59.2 C60.2 C61.2 C62.2 C64.2 C65.2 C66.2 C67.2 C68.2 C69.1 C70.1 C71.1 C72.1
VCC_3V3: L1.1 L3.1
VCC_FPGA: C2.1 C3.1 C4.1 C5.1 C6.1 C7.1 C9.1 C10.2 C11.2 C12.1 C13.1 C15.1 C16.1 C17.1 C23.1 C24.1 C45.1 C46.2 C47.1 C48.1 C49.1 C51.1 C52.1 C53.1 C54.1 C55.2 C56.2 C57.1 C58.1 C59.1 C60.1 C61.1 C62.1 C64.1 C65.1 C66.1 C67.1 C68.1 C69.2 C70.2 C71.2 C72.2 L1.2 L3.2 ; port VCC_FPGA

### Channels
F1/POWER: designators end in _F1_POWER; ports VCC_FPGA=VCC_FPGA
F2/POWER: designators end in _F2_POWER; ports VCC_FPGA=VCC_FPGA
F3/POWER: designators end in _F3_POWER; ports VCC_FPGA=VCC_FPGA
F4/POWER: designators end in _F4_POWER; ports VCC_FPGA=VCC_FPGA

### Library data of the parts
C2 C3 C53 = Cap: Multilayer Ceramic Capacitors MLCC - SMD/SMT 16V 0.01uF X7R 0603 10% AEC-Q200; Mfr: KEMET; Mfr Part No: C0603C103K4RECAUTO; Package: 0603; Price: 0.151; Stockiest: MOUSER; Stockiest Part No: 80-C0603C103K4RECAUT; Value: 0.01uF/16V
C4-C6 C9 C12 C13 C15-C17 C23 C24 C45 C48 C49 C51 C52 C57-C62 C64-C67 = Cap: as C1 on sheet FPGA_IO; Package: 0603; Price: 0.101; Stockiest: MOUSER; Stockiest Part No: 963-EMK107B7104KAHT; Value: 0.1uF/16V
C7 C47 C54 C68 = Cap: Multilayer Ceramic Capacitors MLCC - SMD/SMT 16V 0.47uF 0603 X7R 5% AEC-Q200; Mfr: KEMET; Mfr Part No: C0603C474J4RACAUTO; Package: 0603; Price: 0.444; Stockiest: MOUSER; Stockiest Part No: 80-C0603C474J4RAUTO; Value: 0.47uF/16V
C10 C46 C55 C69 C70 = Cap: Multilayer Ceramic Capacitors MLCC - SMD/SMT 0805 25VDC 10uF 20% X5R; Mfr: Taiyo Yuden; Mfr Part No: TMK212BBJ106MG-T; Package: 0805; Price: 0.232; Stockiest: MOUSER; Stockiest Part No: 963-TMK212BBJ106MG-T; Value: 10uF/25V
C11 C56 C71 C72 = Cap: Multilayer Ceramic Capacitors MLCC - SMD/SMT 1210 25VDC 22uF 20% X7R AEC-Q200; Mfr: TDK; Mfr Part No: C1608X5R1A226M080AC; Package: 0603; Price: 0.413; Stockiest: MOUSER; Stockiest Part No: 810-C1608X5R1A226M; Value: 22uF/10V
L1 L3 = 0805_IND: Ferrite Beads 100ohms 1A 60mOhms 0603 Ferrite Chip; Mfr: TDK; Mfr Part No: MPZ1608D101BTA00; Value: 100R/1A; Package: 0603; Price: 0.10; Stockiest: MOUSER; Stockiest Part No: 810-MPZ1608D101BTA00

## Sheet VoltageHeaders.SchDoc
size 381 x 317 mm
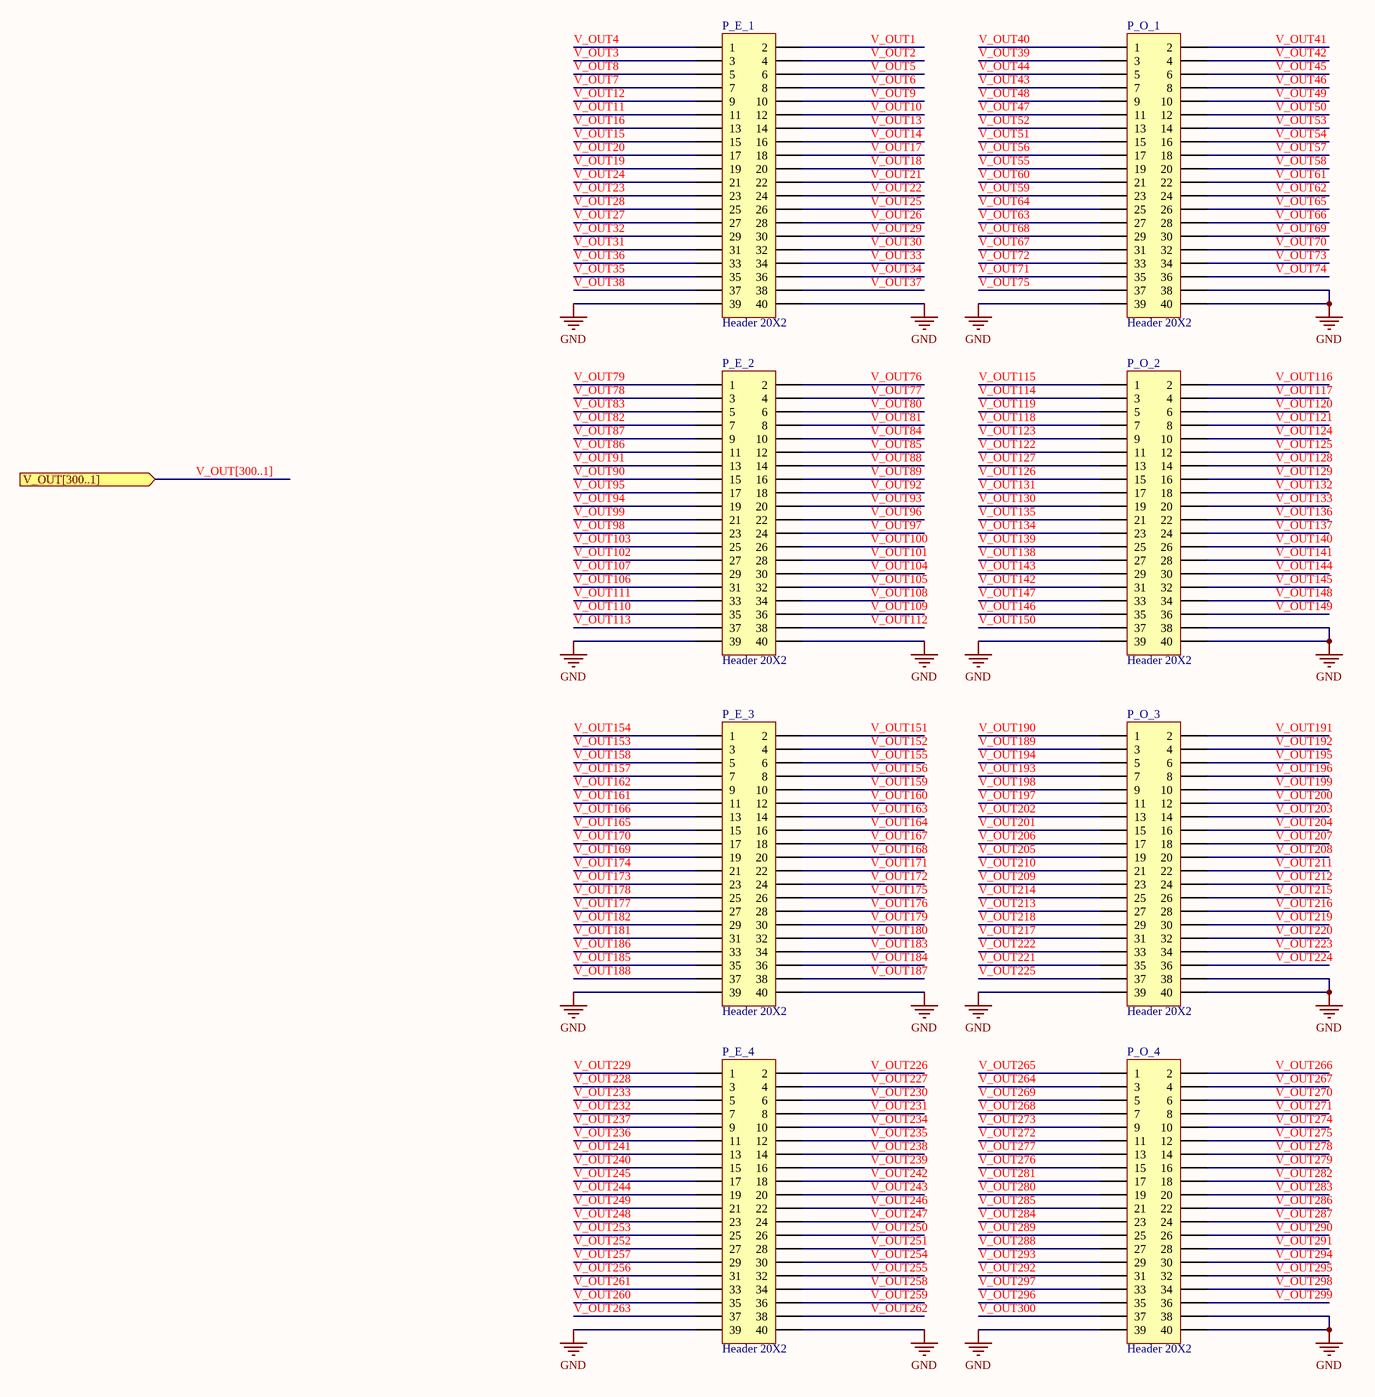
[diagram p4: VoltageHeaders.SchDoc]

### Parts
P_E_1  Header 20X2  [HDR2X20]
P_E_2  Header 20X2  [HDR2X20]
P_E_3  Header 20X2  [HDR2X20]
P_E_4  Header 20X2  [HDR2X20]
P_O_1  Header 20X2  [HDR2X20]
P_O_2  Header 20X2  [HDR2X20]
P_O_3  Header 20X2  [HDR2X20]
P_O_4  Header 20X2  [HDR2X20]

### Ports
V_OUT[300..1] (in)

### Nets
GND: P_E_1.39 P_E_1.40 P_E_2.39 P_E_2.40 P_E_3.39 P_E_3.40 P_E_4.39 P_E_4.40 P_O_1.38 P_O_1.39 P_O_1.40 P_O_2.38 P_O_2.39 P_O_2.40 P_O_3.38 P_O_3.39 P_O_3.40 P_O_4.38 P_O_4.39 P_O_4.40
V_OUT1: P_E_1.2
V_OUT2: P_E_1.4
V_OUT3: P_E_1.3
V_OUT4: P_E_1.1
V_OUT5: P_E_1.6
V_OUT6: P_E_1.8
V_OUT7: P_E_1.7
V_OUT8: P_E_1.5
V_OUT9: P_E_1.10
V_OUT10: P_E_1.12
V_OUT11: P_E_1.11
V_OUT12: P_E_1.9
V_OUT13: P_E_1.14
V_OUT14: P_E_1.16
V_OUT15: P_E_1.15
V_OUT16: P_E_1.13
V_OUT17: P_E_1.18
V_OUT18: P_E_1.20
V_OUT19: P_E_1.19
V_OUT20: P_E_1.17
V_OUT21: P_E_1.22
V_OUT22: P_E_1.24
V_OUT23: P_E_1.23
V_OUT24: P_E_1.21
V_OUT25: P_E_1.26
V_OUT26: P_E_1.28
V_OUT27: P_E_1.27
V_OUT28: P_E_1.25
V_OUT29: P_E_1.30
V_OUT30: P_E_1.32
V_OUT31: P_E_1.31
V_OUT32: P_E_1.29
V_OUT33: P_E_1.34
V_OUT34: P_E_1.36
V_OUT35: P_E_1.35
V_OUT36: P_E_1.33
V_OUT37: P_E_1.38
V_OUT38: P_E_1.37
V_OUT39: P_O_1.3
V_OUT40: P_O_1.1
V_OUT41: P_O_1.2
V_OUT42: P_O_1.4
V_OUT43: P_O_1.7
V_OUT44: P_O_1.5
V_OUT45: P_O_1.6
V_OUT46: P_O_1.8
V_OUT47: P_O_1.11
V_OUT48: P_O_1.9
V_OUT49: P_O_1.10
V_OUT50: P_O_1.12
V_OUT51: P_O_1.15
V_OUT52: P_O_1.13
V_OUT53: P_O_1.14
V_OUT54: P_O_1.16
V_OUT55: P_O_1.19
V_OUT56: P_O_1.17
V_OUT57: P_O_1.18
V_OUT58: P_O_1.20
V_OUT59: P_O_1.23
V_OUT60: P_O_1.21
V_OUT61: P_O_1.22
V_OUT62: P_O_1.24
V_OUT63: P_O_1.27
V_OUT64: P_O_1.25
V_OUT65: P_O_1.26
V_OUT66: P_O_1.28
V_OUT67: P_O_1.31
V_OUT68: P_O_1.29
V_OUT69: P_O_1.30
V_OUT70: P_O_1.32
V_OUT71: P_O_1.35
V_OUT72: P_O_1.33
V_OUT73: P_O_1.34
V_OUT74: P_O_1.36
V_OUT75: P_O_1.37
V_OUT76: P_E_2.2  [project net V_OUT1]
V_OUT77: P_E_2.4  [project net V_OUT2]
V_OUT78: P_E_2.3  [project net V_OUT3]
V_OUT79: P_E_2.1  [project net V_OUT4]
V_OUT80: P_E_2.6  [project net V_OUT5]
V_OUT81: P_E_2.8  [project net V_OUT6]
V_OUT82: P_E_2.7  [project net V_OUT7]
V_OUT83: P_E_2.5  [project net V_OUT8]
V_OUT84: P_E_2.10
V_OUT85: P_E_2.12  [project net V_OUT10]
V_OUT86: P_E_2.11  [project net V_OUT11]
V_OUT87: P_E_2.9  [project net V_OUT12]
V_OUT88: P_E_2.14  [project net V_OUT13]
V_OUT89: P_E_2.16  [project net V_OUT14]
V_OUT90: P_E_2.15  [project net V_OUT15]
V_OUT91: P_E_2.13  [project net V_OUT16]
V_OUT92: P_E_2.18  [project net V_OUT17]
V_OUT93: P_E_2.20  [project net V_OUT18]
V_OUT94: P_E_2.19  [project net V_OUT19]
V_OUT95: P_E_2.17  [project net V_OUT20]
V_OUT96: P_E_2.22  [project net V_OUT21]
V_OUT97: P_E_2.24  [project net V_OUT22]
V_OUT98: P_E_2.23  [project net V_OUT23]
V_OUT99: P_E_2.21  [project net V_OUT24]
V_OUT100: P_E_2.26
V_OUT101: P_E_2.28
V_OUT102: P_E_2.27
V_OUT103: P_E_2.25
V_OUT104: P_E_2.30
V_OUT105: P_E_2.32
V_OUT106: P_E_2.31
V_OUT107: P_E_2.29
V_OUT108: P_E_2.34
V_OUT109: P_E_2.36
V_OUT110: P_E_2.35
V_OUT111: P_E_2.33
V_OUT112: P_E_2.38
V_OUT113: P_E_2.37
V_OUT114: P_O_2.3
V_OUT115: P_O_2.1
V_OUT116: P_O_2.2
V_OUT117: P_O_2.4
V_OUT118: P_O_2.7
V_OUT119: P_O_2.5
V_OUT120: P_O_2.6
V_OUT121: P_O_2.8
V_OUT122: P_O_2.11
V_OUT123: P_O_2.9
V_OUT124: P_O_2.10
V_OUT125: P_O_2.12
V_OUT126: P_O_2.15
V_OUT127: P_O_2.13
V_OUT128: P_O_2.14
V_OUT129: P_O_2.16
V_OUT130: P_O_2.19
V_OUT131: P_O_2.17
V_OUT132: P_O_2.18
V_OUT133: P_O_2.20
V_OUT134: P_O_2.23
V_OUT135: P_O_2.21
V_OUT136: P_O_2.22
V_OUT137: P_O_2.24
V_OUT138: P_O_2.27
V_OUT139: P_O_2.25
V_OUT140: P_O_2.26
V_OUT141: P_O_2.28
V_OUT142: P_O_2.31
V_OUT143: P_O_2.29
V_OUT144: P_O_2.30
V_OUT145: P_O_2.32
V_OUT146: P_O_2.35
V_OUT147: P_O_2.33
V_OUT148: P_O_2.34
V_OUT149: P_O_2.36
V_OUT150: P_O_2.37
V_OUT151: P_E_3.2  [project net V_OUT1]
V_OUT152: P_E_3.4
V_OUT153: P_E_3.3
V_OUT154: P_E_3.1
V_OUT155: P_E_3.6
V_OUT156: P_E_3.8
V_OUT157: P_E_3.7
V_OUT158: P_E_3.5
V_OUT159: P_E_3.10
V_OUT160: P_E_3.12  [project net V_OUT10]
V_OUT161: P_E_3.11  [project net V_OUT11]
V_OUT162: P_E_3.9  [project net V_OUT12]
V_OUT163: P_E_3.14  [project net V_OUT13]
V_OUT164: P_E_3.16  [project net V_OUT14]
V_OUT165: P_E_3.15  [project net V_OUT15]
V_OUT166: P_E_3.13  [project net V_OUT16]
V_OUT167: P_E_3.18
V_OUT168: P_E_3.20
V_OUT169: P_E_3.19
V_OUT170: P_E_3.17
V_OUT171: P_E_3.22
V_OUT172: P_E_3.24
V_OUT173: P_E_3.23
V_OUT174: P_E_3.21
V_OUT175: P_E_3.26
V_OUT176: P_E_3.28
V_OUT177: P_E_3.27
V_OUT178: P_E_3.25
V_OUT179: P_E_3.30
V_OUT180: P_E_3.32
V_OUT181: P_E_3.31
V_OUT182: P_E_3.29
V_OUT183: P_E_3.34
V_OUT184: P_E_3.36
V_OUT185: P_E_3.35
V_OUT186: P_E_3.33
V_OUT187: P_E_3.38
V_OUT188: P_E_3.37
V_OUT189: P_O_3.3
V_OUT190: P_O_3.1
V_OUT191: P_O_3.2
V_OUT192: P_O_3.4
V_OUT193: P_O_3.7
V_OUT194: P_O_3.5
V_OUT195: P_O_3.6
V_OUT196: P_O_3.8
V_OUT197: P_O_3.11
V_OUT198: P_O_3.9
V_OUT199: P_O_3.10
V_OUT200: P_O_3.12
V_OUT201: P_O_3.15
V_OUT202: P_O_3.13
V_OUT203: P_O_3.14
V_OUT204: P_O_3.16
V_OUT205: P_O_3.19
V_OUT206: P_O_3.17
V_OUT207: P_O_3.18
V_OUT208: P_O_3.20
V_OUT209: P_O_3.23
V_OUT210: P_O_3.21
V_OUT211: P_O_3.22
V_OUT212: P_O_3.24
V_OUT213: P_O_3.27
V_OUT214: P_O_3.25
V_OUT215: P_O_3.26
V_OUT216: P_O_3.28
V_OUT217: P_O_3.31
V_OUT218: P_O_3.29
V_OUT219: P_O_3.30
V_OUT220: P_O_3.32
V_OUT221: P_O_3.35
V_OUT222: P_O_3.33
V_OUT223: P_O_3.34
V_OUT224: P_O_3.36
V_OUT225: P_O_3.37
V_OUT226: P_E_4.2  [project net V_OUT1]
V_OUT227: P_E_4.4  [project net V_OUT2]
V_OUT228: P_E_4.3
V_OUT229: P_E_4.1
V_OUT230: P_E_4.6
V_OUT231: P_E_4.8
V_OUT232: P_E_4.7
V_OUT233: P_E_4.5
V_OUT234: P_E_4.10
V_OUT235: P_E_4.12  [project net V_OUT10]
V_OUT236: P_E_4.11  [project net V_OUT11]
V_OUT237: P_E_4.9  [project net V_OUT12]
V_OUT238: P_E_4.14  [project net V_OUT13]
V_OUT239: P_E_4.16  [project net V_OUT14]
V_OUT240: P_E_4.15  [project net V_OUT15]
V_OUT241: P_E_4.13  [project net V_OUT16]
V_OUT242: P_E_4.18  [project net V_OUT17]
V_OUT243: P_E_4.20  [project net V_OUT18]
V_OUT244: P_E_4.19  [project net V_OUT19]
V_OUT245: P_E_4.17  [project net V_OUT20]
V_OUT246: P_E_4.22  [project net V_OUT21]
V_OUT247: P_E_4.24  [project net V_OUT22]
V_OUT248: P_E_4.23  [project net V_OUT23]
V_OUT249: P_E_4.21  [project net V_OUT24]
V_OUT250: P_E_4.26  [project net V_OUT25]
V_OUT251: P_E_4.28
V_OUT252: P_E_4.27
V_OUT253: P_E_4.25
V_OUT254: P_E_4.30
V_OUT255: P_E_4.32
V_OUT256: P_E_4.31
V_OUT257: P_E_4.29
V_OUT258: P_E_4.34
V_OUT259: P_E_4.36
V_OUT260: P_E_4.35
V_OUT261: P_E_4.33
V_OUT262: P_E_4.38
V_OUT263: P_E_4.37
V_OUT264: P_O_4.3
V_OUT265: P_O_4.1
V_OUT266: P_O_4.2
V_OUT267: P_O_4.4
V_OUT268: P_O_4.7
V_OUT269: P_O_4.5
V_OUT270: P_O_4.6
V_OUT271: P_O_4.8
V_OUT272: P_O_4.11
V_OUT273: P_O_4.9
V_OUT274: P_O_4.10
V_OUT275: P_O_4.12
V_OUT276: P_O_4.15
V_OUT277: P_O_4.13
V_OUT278: P_O_4.14
V_OUT279: P_O_4.16
V_OUT280: P_O_4.19
V_OUT281: P_O_4.17
V_OUT282: P_O_4.18
V_OUT283: P_O_4.20
V_OUT284: P_O_4.23
V_OUT285: P_O_4.21
V_OUT286: P_O_4.22
V_OUT287: P_O_4.24
V_OUT288: P_O_4.27
V_OUT289: P_O_4.25
V_OUT290: P_O_4.26
V_OUT291: P_O_4.28
V_OUT292: P_O_4.31
V_OUT293: P_O_4.29
V_OUT294: P_O_4.30
V_OUT295: P_O_4.32
V_OUT296: P_O_4.35
V_OUT297: P_O_4.33
V_OUT298: P_O_4.34
V_OUT299: P_O_4.36
V_OUT300: P_O_4.37

### Buses and harness runs
bus V_OUT[300..1] = port V_OUT[300..1]

### Library data of the parts
P_E_1-P_E_4 P_O_1-P_O_4 = Header 20X2: Headers & Wire Housings 2X20 POS VERT TIN; Mfr: TE Connectivity / AMP; Mfr Part No: 2-826942-0; Value: 40; Package: DIN; Price: 2.5; Stockiest: MOUSER; Stockiest Part No: 571-2-826942-0

## Sheet POWER_VOLTAGE.SchDoc
size B
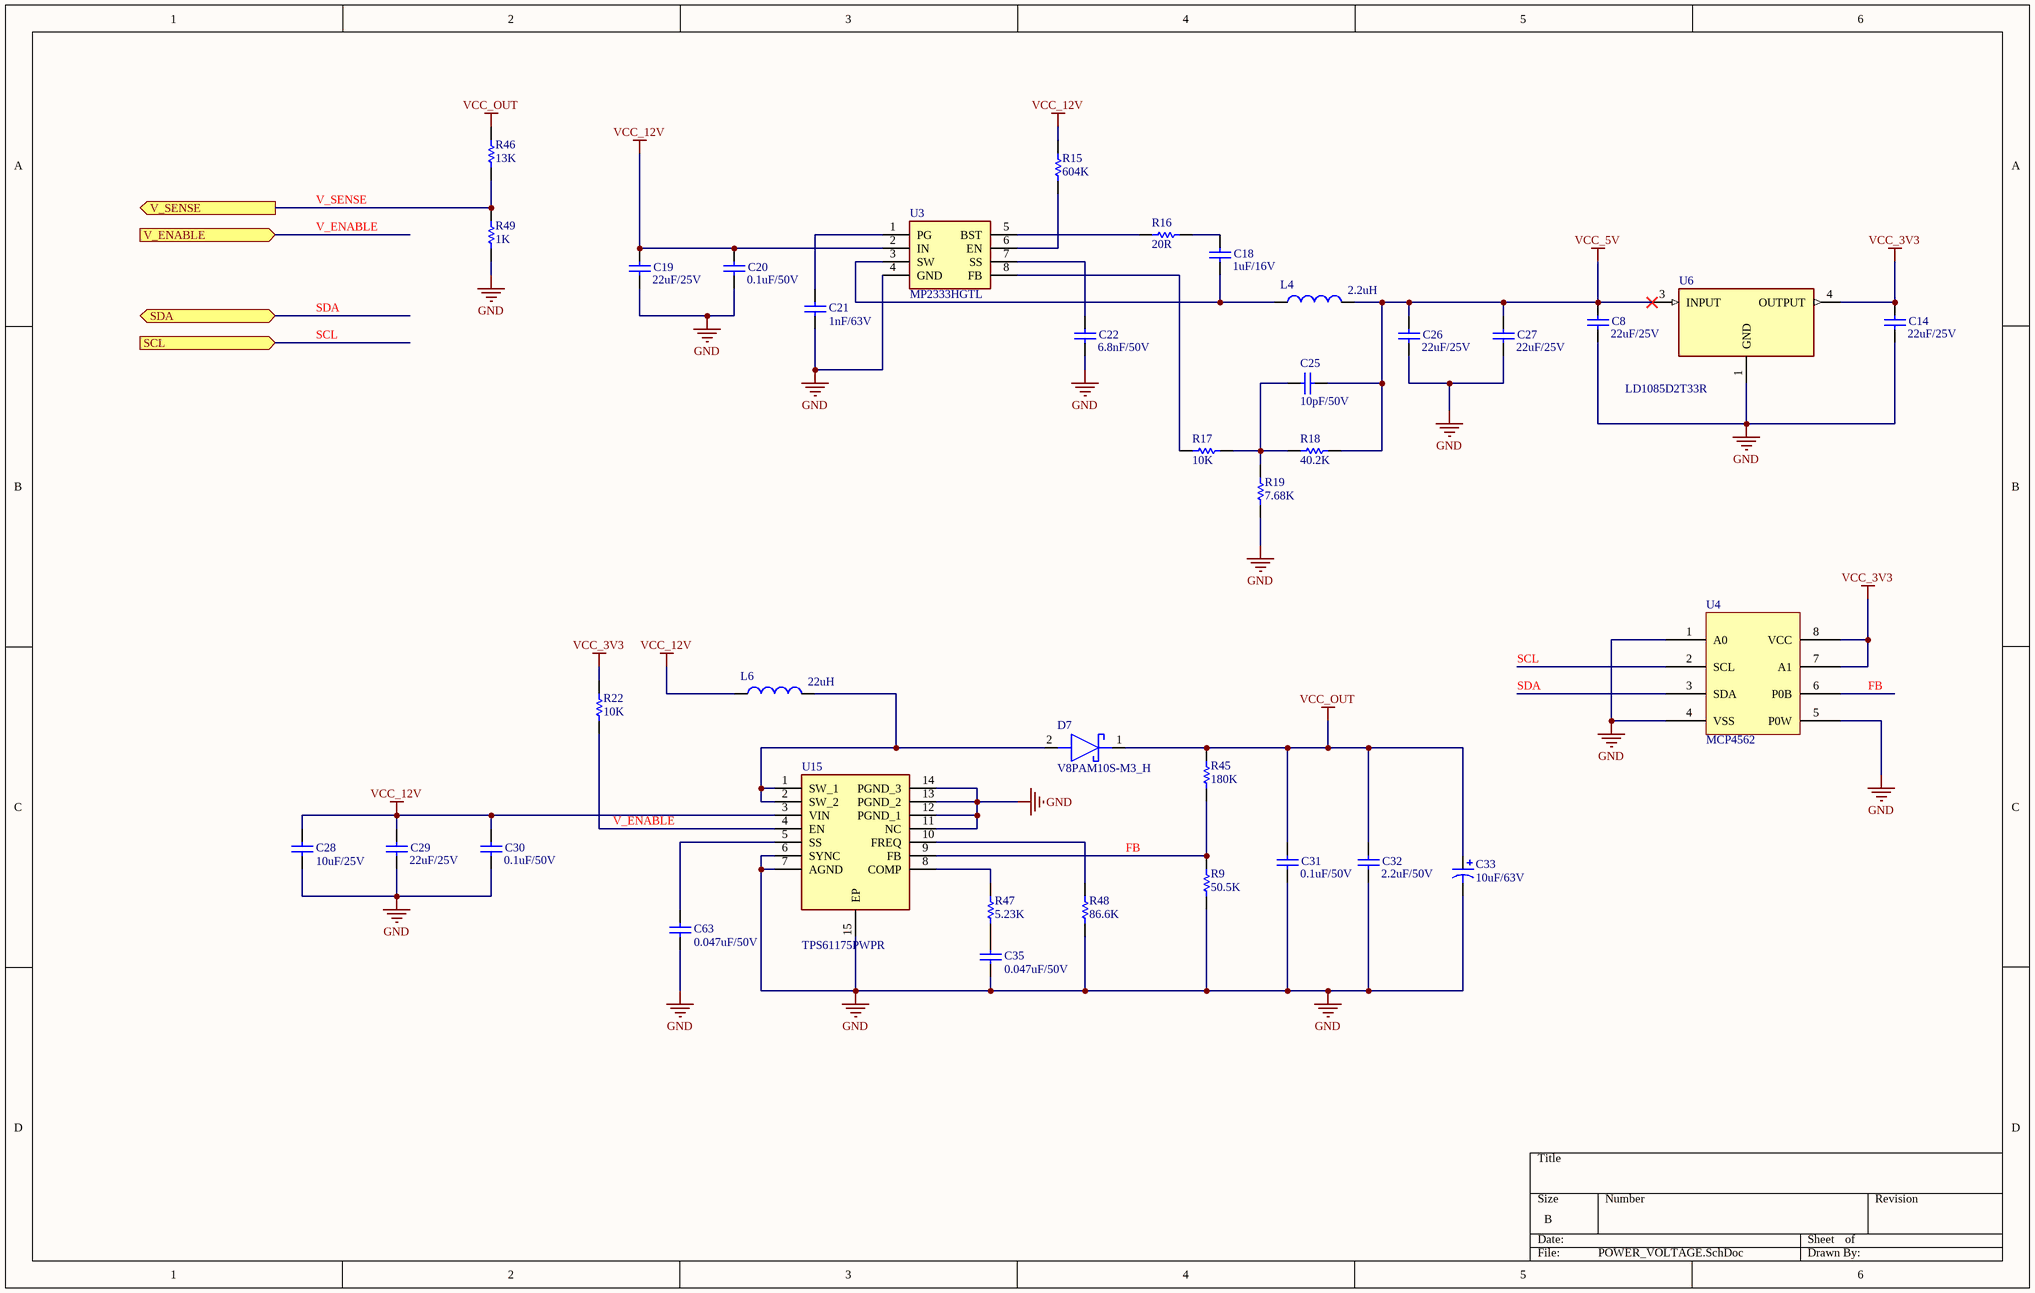
[diagram p5: POWER_VOLTAGE.SchDoc]

### Parts
C8  22uF/25V  [1210C]
C14  22uF/25V  [1210C]
C18  1uF/16V  [0603C]
C19  22uF/25V  [1210C]
C20  0.1uF/50V  [0603C]
C21  1nF/63V  [0603C]
C22  6.8nF/50V  [0603C]
C25  10pF/50V  [0603C]
C26  22uF/25V  [1210C]
C27  22uF/25V  [1210C]
C28  10uF/25V  [0805C]
C29  22uF/25V  [1210C]
C30  0.1uF/50V  [0603C]
C31  0.1uF/50V  [0603C]
C32  2.2uF/50V  [0603C]
C33  10uF/63V  [EEE-FN1J100L]
C35  0.047uF/50V  [0603C]
C63  0.047uF/50V  [0603C]
D7  V8PAM10S-M3_H  [V8PAM10SHM3H]
L4  2.2uH  [IHLP1616BZER2R2M5A]
L6  22uH  [CDRH124NP-220MC]
R9  50.5K  [0603R]
R15  604K  [0603R]
R16  20R  [0603R]
R17  10K  [0603R]
R18  40.2K  [0603R]
R19  7.68K  [0603R]
R22  10K  [0603R]
R45  180K  [0603R]
R46  13K  [0603R]
R47  5.23K  [0603R]
R48  86.6K  [0603R]
R49  1K  [0603R]
U3  MP2333HGTL  [MP2333HGTL-P]
U4  MCP4562  [MCP4562T-503E/MS]
U6  LD1085D2T33R  [LD1085D2T33R]
U15  TPS61175PWPR  [TPS61175PWPR]

### Ports
SCL (in), SDA (bidir), V_ENABLE (in), V_SENSE (out)

### Nets
GND: C8.1 C14.1 C19.1 C20.1 C21.1 C22.1 C26.1 C27.1 C28.1 C29.1 C30.1 C31.1 C32.1 C33.2 C35.1 C63.1 R9.2 R19.2 R48.1 R49.1 U3.4(GND) U4.1(A0) U4.4(VSS) U4.5(P0W) U6.1(GND) U15.6(SYNC) U15.7(AGND) U15.11(NC) U15.12(PGND_1) U15.13(PGND_2) U15.14(PGND_3) U15.15(EP)
VCC_3V3: C14.2 R22.1 U4.7(A1) U4.8(VCC) U6.4(OUTPUT)
VCC_5V: C8.2 C25.1 C26.2 C27.2 L4.2 R18.2 U6.3(INPUT)
VCC_12V: C19.2 C20.2 C28.2 C29.2 C30.2 L6.1 R15.2 U3.2(IN) U15.3(VIN)
VCC_OUT: C31.2 C32.2 C33.1 D7.1(K) R45.1 R46.1
FB: R9.1 R45.2 U4.6(P0B) U15.9(FB)
SCL: U4.2(SCL) ; port SCL
SDA: U4.3(SDA) ; port SDA
V_ENABLE: R22.2 U15.4(EN) ; port V_ENABLE  [project net BANK_EN2]
V_SENSE: R46.2 R49.2 ; port V_SENSE
NetC18_1: C18.1 L4.1 U3.3(SW)
NetC18_2: C18.2 R16.2
NetC21_2: C21.2 U3.1(PG)
NetC22_2: C22.2 U3.7(SS)
NetC25_2: C25.2 R17.1 R18.1 R19.1
NetC35_2: C35.2 R47.1
NetC63_2: C63.2 U15.5(SS)
NetD7_2: D7.2(A) L6.2 U15.1(SW_1) U15.2(SW_2)
NetR15_1: R15.1 U3.6(EN)
NetR16_1: R16.1 U3.5(BST)
NetR17_2: R17.2 U3.8(FB)
NetR47_2: R47.2 U15.8(COMP)
NetR48_2: R48.2 U15.10(FREQ)

### Library data of the parts
C8 C14 C19 C26 C27 C29 = Cap: Multilayer Ceramic Capacitors MLCC - SMD/SMT 1210 25VDC 22uF 20% X7R AEC-Q200; Mfr: Taiyo Yuden; Mfr Part No: TMK325B7226MMHP; Package: 1210; Price: 0.807; Stockiest: MOUSER; Stockiest Part No: 963-TMK325B7226MMHP; Value: 22uF/25V
C18 = Cap: Multilayer Ceramic Capacitors MLCC - SMD/SMT 16volts 1uF X7R 10%; Mfr: KEMET; Mfr Part No: C0603C105K4RAC7411; Package: 0603; Price: 0.101; Stockiest: MOUSER; Stockiest Part No: 80-C0603C105K4RLR; Value: 1uF/16V
C20 C30 C31 = Cap: as C40 on sheet TOP_VOLTAGE; Package: 0603; Price: 0.101; Stockiest: MOUSER; Stockiest Part No: 80-C0603C104M5R; Value: 0.1uF/50V
C21 = Cap: Multilayer Ceramic Capacitors MLCC - SMD/SMT 63V 1000pF 0603 X7R 10% AEC-Q200; Mfr: KEMET; Mfr Part No: 80-C0603C102KMREAUTO; Package: 0603; Price: 0.201; Stockiest: MOUSER; Stockiest Part No: C0603C102KMRECAUTO; Value: 1nF/63V
C22 = Cap: Multilayer Ceramic Capacitors MLCC - SMD/SMT 0603 50VDC 6.8nF 5% C0G AEC-Q200; Mfr: TDK; Mfr Part No: CGA3E2C0G1H682J080AE; Package: 0603; Price: 0.363; Stockiest: MOUSER; Stockiest Part No: 810-CGA3E2C0G1H682J8; Value: 6.8nF/50V
C25 = Cap: as C36 on sheet TOP_VOLTAGE; Package: 0603; Price: 0.192; Stockiest: MOUSER; Stockiest Part No: 80-C0603C100J5GAUTO; Value: 10pF/50V
C28 = Cap: as C10 on sheet FPGA_POWER; Package: 0805; Price: 0.232; Stockiest: MOUSER; Stockiest Part No: 963-TMK212BBJ106MG-T; Value: 10uF/25V
C32 = Cap: Multilayer Ceramic Capacitors MLCC - SMD/SMT 0603 2.2uF 20% 50VDC X5R; Mfr: Murata Electronics; Mfr Part No: GRM188R61H225ME11J; Package: 0603; Price: 0.333; Stockiest: MOUSER; Stockiest Part No: 81-GRM188R61H225ME1J; Value: 2.2uF/50V
C33 = Cap Pol1: Polarized Capacitor (Radial); Mfr: Panasonic; Value: 10uF/63V; Mfr Part No: EEE-FN1J100L; Package: SMD; Stockiest: MOUSER; Price: 0.484; Stockiest Part No: 667-EEE-FN1J100L
C35 C63 = Cap: Multilayer Ceramic Capacitors MLCC - SMD/SMT 50V 0.047uF 0603 X7R 10%; Mfr: KEMET; Mfr Part No: C0603C473K5RAC7411; Package: 0603; Price: 0.121; Stockiest: MOUSER; Stockiest Part No: 80-C0603C473K5RLR; Value: 0.047uF/50V
D7 = V8PAM10S-M3_H: Schottky Diodes & Rectifiers 8A 100V; Mfr: Vishay General Semiconductor; Mfr Part No: V8PAM10S-M3/H; Price: 0.39; Stockiest: MOUSER; Stockiest Part No: 78-V8PAM10S-M3/H
L4 = INDUCTOR: Fixed Inductors 2.2uH 20% High Temp AEC-Q200; Mfr: Vishay / Dale; Mfr Part No: IHLP1616BZER2R2M5A; Price: 1.36; Stockiest: MOUSER; Stockiest Part No: 70-IHLP1616BZR2R2M5A; Value: 2.2uH
L6 = INDUCTOR: Fixed Inductors 22uH 2.9A 20% SMD PWR INDUCTOR; Mfr: Sumida; Mfr Part No: CDRH124NP-220MC; Price: 1.42; Stockiest: MOUSER; Stockiest Part No: 851-CDRH124NP-220MC; Value: 22uH
R9 = Res1: Thin Film Resistors - SMD 50.5kOhm,0603,0.1%,2 5ppm,63mW,50V; Mfr: KOA Speer; Mfr Part No: RN731JTTD5052B25; Package: 0603; Price: 0.8; Stockiest: MOUSER; Stockiest Part No: 660-RN731JTTD5052B25; Value: 50.5K
R15 = Res1: Thick Film Resistors - SMD 0603 1% 604Kohm Anti-Sulfur AEC-Q200; Mfr: Panasonic; Mfr Part No: ERJ-U03F6043V; Package: 0603; Price: 0.221; Stockiest: MOUSER; Stockiest Part No: 667-ERJ-U03F6043V; Value: 604K
R16 = Res1: Thick Film Resistors - SMD 0603 0.25W 1% 20ohm AEC-Q200; Mfr: Panasonic; Mfr Part No: ERJ-UP3F20R0V; Package: 0603; Price: 0.262; Stockiest: MOUSER; Stockiest Part No: 667-ERJ-UP3F20R0V; Value: 20R
R17 R22 = Res1: as R10 on sheet TOP_VOLTAGE; Package: 0603; Price: 0.101; Stockiest: MOUSER; Stockiest Part No: 755-SFR03EZPF1002; Value: 10K
R18 = Res1: Thick Film Resistors - SMD 0603 Anti-Surge Res. 0.1%, 40.2Koh; Mfr: Panasonic; Mfr Part No: ERJ-PB3B4022V; Package: 0603; Price: 0.252; Stockiest: MOUSER; Stockiest Part No: 667-ERJ-PB3B4022V; Value: 40.2K
R19 = Res1: Thick Film Resistors - SMD 0603 Anti-Surge Res. 0.1%, 7.68Koh; Mfr: Panasonic; Mfr Part No: ERJ-PB3B7681V; Package: 0603; Price: 0.252; Stockiest: MOUSER; Stockiest Part No: 667-ERJ-PB3B7681V; Value: 7.68K
R45 = Res1: Thin Film Resistors - SMD 180K ohm 0.1% 50 ppm; Mfr: KOA Speer; Mfr Part No: RN73R1JTTD1803B50; Package: 0603; Price: 0.8; Stockiest: MOUSER; Stockiest Part No: 660-RN73R1JTD1803B50; Value: 180K
R46 = Res1: Thin Film Resistors - SMD 13K ohm 0.1% 25 ppm; Mfr: KOA Speer; Mfr Part No: RN73R1JTTD1302B25; Package: 0603; Price: 0.503; Stockiest: MOUSER; Stockiest Part No: 660-RN73R1JTD1302B25; Value: 13K
R47 = Res1: Thick Film Resistors - SMD 0603 5.23Kohms 1% AEC-Q200; Mfr: Panasonic; Mfr Part No: ERJ-3EKF5231V; Package: 0603; Price: 0.101; Stockiest: MOUSER; Stockiest Part No: 667-ERJ-3EKF5231V; Value: 5.23K
R48 = Res1: Thick Film Resistors - SMD 0603 86.6Kohms 1% AEC-Q200; Mfr: Panasonic; Mfr Part No: ERJ-3EKF8662V; Package: 0603; Price: 0.101; Stockiest: MOUSER; Stockiest Part No: 667-ERJ-3EKF8662V; Value: 86.6K
R49 = Res1: as R12 on sheet TOP_VOLTAGE; Package: 0603; Price: 0.1; Stockiest: MOUSER; Stockiest Part No: 71-CRCW06031K00FKEAC; Value: 1K
U3 = MP2333HGTL: Switching Voltage Regulators High-Efficiency, 3A, 18V, 1200kHz, Synchronous, Step-Down Converter; Mfr: Monolithic Power Systems (MPS); Value: 3.3V; Mfr Part No: MP2333HGTL-P; Price: 1.89; Stockiest: MOUSER; Stockiest Part No: 946-MP2333HGTL-P
U4 = MCP4562: Digital Potentiometer ICs Sngl 8B NV I2C Rheo; Mfr: Microchip Technology; Value: 50K; Mfr Part No: MCP4562T-503E/MS; Price: 0.97; Stockiest: MOUSER; Stockiest Part No: 579-MCP4562T-503E/MS
U6 = LD1085D2T33R: Integrated Circuit; Mfr: STMicroelectronics; Value: 3.3V; Mfr Part No: LD1085D2T33R; Price: 1.30; Stockiest: MOUSER; Stockiest Part No: 511-LD1085D2T33-TR
U15 = TPS61175PWP: Switching Voltage Regulators 3A High Vltg Boost Converter; Mfr: Texas Instruments; Mfr Part No: TPS61175PWPR; Price: 3.06; Stockiest: MOUSER; Stockiest Part No: 595-TPS61175PWPR

## Sheet Power_ORing.SchDoc
size B
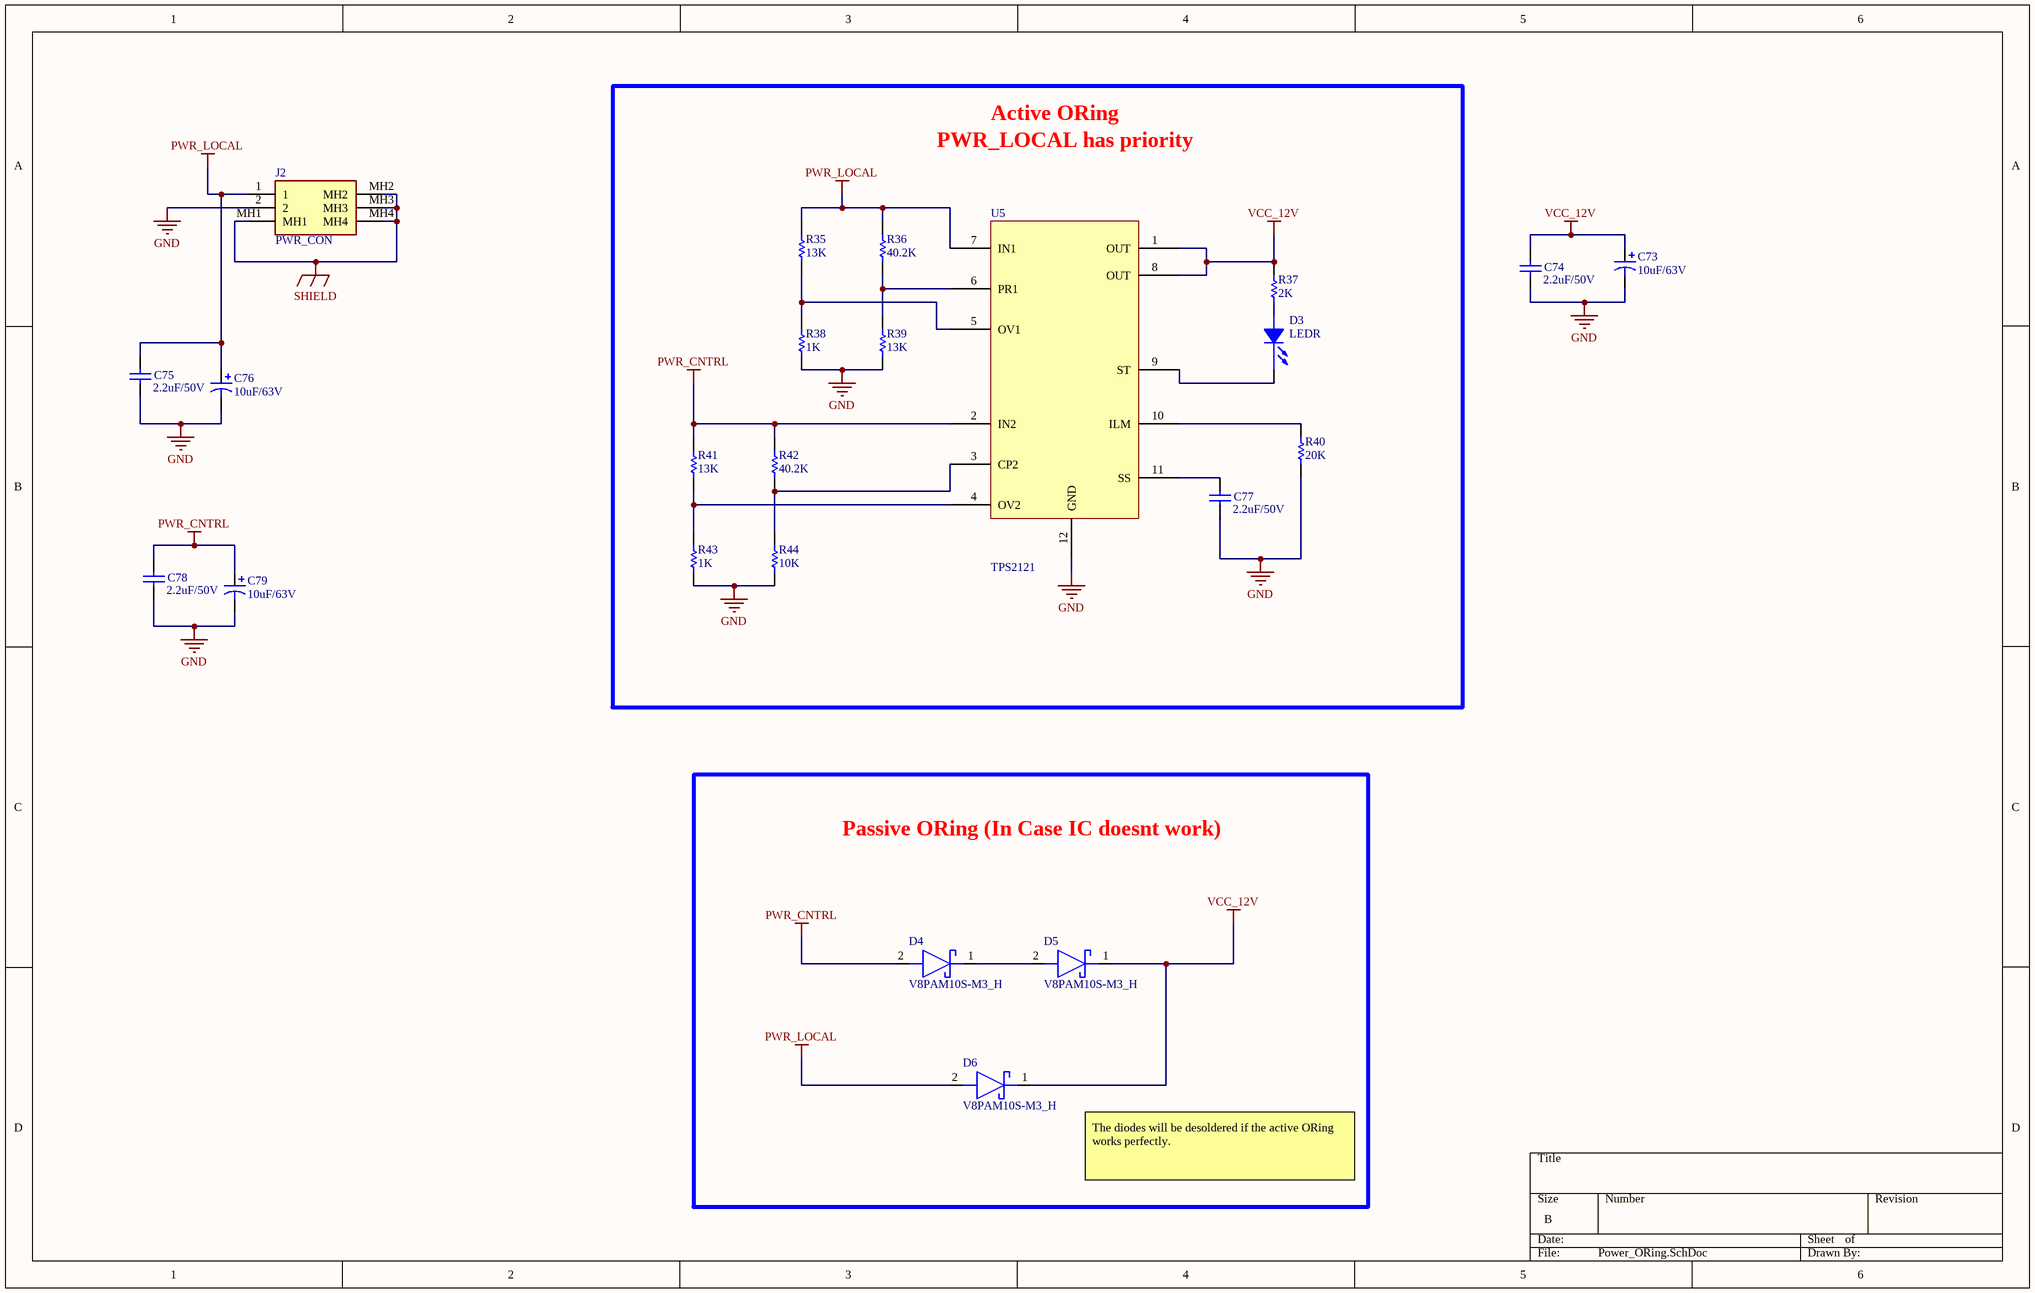
[diagram p6: Power_ORing.SchDoc]

### Parts
C73  10uF/63V  [EEE-FN1J100L]
C74  2.2uF/50V  [0603C]
C75  2.2uF/50V  [0603C]
C76  10uF/63V  [EEE-FN1J100L]
C77  2.2uF/50V  [0603C]
C78  2.2uF/50V  [0603C]
C79  10uF/63V  [EEE-FN1J100L]
D3  LEDR  [LED_0603]
D4  V8PAM10S-M3_H  [V8PAM10SHM3H]
D5  V8PAM10S-M3_H  [V8PAM10SHM3H]
D6  V8PAM10S-M3_H  [V8PAM10SHM3H]
J2  PWR_CON  [PJ082BH]
R35  13K  [0603R]
R36  40.2K  [0603R]
R37  2K  [0603R]
R38  1K  [0603R]
R39  13K  [0603R]
R40  20K  [0603R]
R41  13K  [0603R]
R42  40.2K  [0603R]
R43  1K  [0603R]
R44  10K  [0603R]
U5  TPS2121

### Blocks framed on the sheet
Passive ORing (In Case IC doesnt work): D4-D6

### Nets
GND: C73.2 C74.1 C75.1 C76.2 C77.1 C78.1 C79.2 J2.2 R38.1 R39.2 R40.2 R43.1 R44.2 U5.12(GND)
PWR_CNTRL: C78.2 C79.1 D4.2(A) R41.1 R42.2 U5.2(IN2)
PWR_LOCAL: C75.2 C76.1 D6.2(A) J2.1 R35.1 R36.2 U5.7(IN1)
SHIELD: J2.MH1 J2.MH2 J2.MH3 J2.MH4
VCC_12V: C73.1 C74.2 D5.1(K) D6.1(K) R37.1 U5.1(OUT) U5.8(OUT)
NetC77_2: C77.2 U5.11(SS)
NetD3_1: D3.1(ANODE) R37.2
NetD3_2: D3.2(CATHODE) U5.9(ST)
NetD4_1: D4.1(K) D5.2(A)
NetR35_2: R35.2 R38.2 U5.5(OV1)
NetR36_1: R36.1 R39.1 U5.6(PR1)
NetR40_1: R40.1 U5.10(ILM)
NetR41_2: R41.2 R43.2 U5.4(OV2)
NetR42_1: R42.1 R44.1 U5.3(CP2)

### Notes on the sheet
- PWR_LOCAL has priority
- Active ORing
- The diodes will be desoldered if the active ORing works perfectly.

### Library data of the parts
C73 C76 C79 = Cap Pol1: as C33 on sheet POWER_VOLTAGE; Value: 10uF/63V; Mfr Part No: EEE-FN1J100L; Package: SMD; Stockiest: MOUSER; Price: 0.484; Stockiest Part No: 667-EEE-FN1J100L
C74 C75 C77 C78 = Cap: as C32 on sheet POWER_VOLTAGE; Package: 0603; Price: 0.333; Stockiest: MOUSER; Stockiest Part No: 81-GRM188R61H225ME1J; Value: 2.2uF/50V
D3 = LED: as D1 on sheet FPGA_IO; Package: 0603; Price: 0.393; Stockiest: MOUSER; Stockiest Part No: 859-LTSTC193KRKT5A; Value: RED
D4-D6 = V8PAM10S-M3_H: as D7 on sheet POWER_VOLTAGE; Price: 0.39; Stockiest: MOUSER; Stockiest Part No: 78-V8PAM10S-M3/H
J2 = PJ-082BH: DC Power Connectors 2.5mm x 5.5mm horz; Mfr: CUI Devices; Mfr Part No: PJ-082BH; Price: 1.70; Stockiest: MOUSER; Stockiest Part No: 490-PJ-082BH
R35 R39 R41 = Res1: as R46 on sheet POWER_VOLTAGE; Package: 0603; Price: 0.503; Stockiest: MOUSER; Stockiest Part No: 660-RN73R1JTD1302B25; Value: 13K
R36 R42 = Res1: as R18 on sheet POWER_VOLTAGE; Package: 0603; Price: 0.252; Stockiest: MOUSER; Stockiest Part No: 667-ERJ-PB3B4022V; Value: 40.2K
R37 R44 = Res1: as R10 on sheet TOP_VOLTAGE; Package: 0603; Price: 0.101; Stockiest: MOUSER; Stockiest Part No: 755-SFR03EZPF1002
  R37: Value: 2K
  R44: Value: 10K
R38 R43 = Res1: as R12 on sheet TOP_VOLTAGE; Package: 0603; Price: 0.1; Stockiest: MOUSER; Stockiest Part No: 71-CRCW06031K00FKEAC; Value: 1K
R40 = Res1: Thick Film Resistors - SMD 20K OHM .1% 25PPM; Mfr: KOA Speer; Mfr Part No: RS73F1JTTD2002B; Package: 0603; Price: 0.61; Stockiest: MOUSER; Stockiest Part No: 660-RS73F1JTTD2002B; Value: 20K
U5 = TPS2121: Power Switch ICs - Power Distribution; Mfr: Texas Instruments; Mfr Part No: TPS2121RUXT; Price: 2.40; Stockiest: MOUSER; Stockiest Part No: 595-TPS2121RUXT